# EAGLE design digitron clock (EAGLE 6.4)

## Sheet 1 of 2: nixies
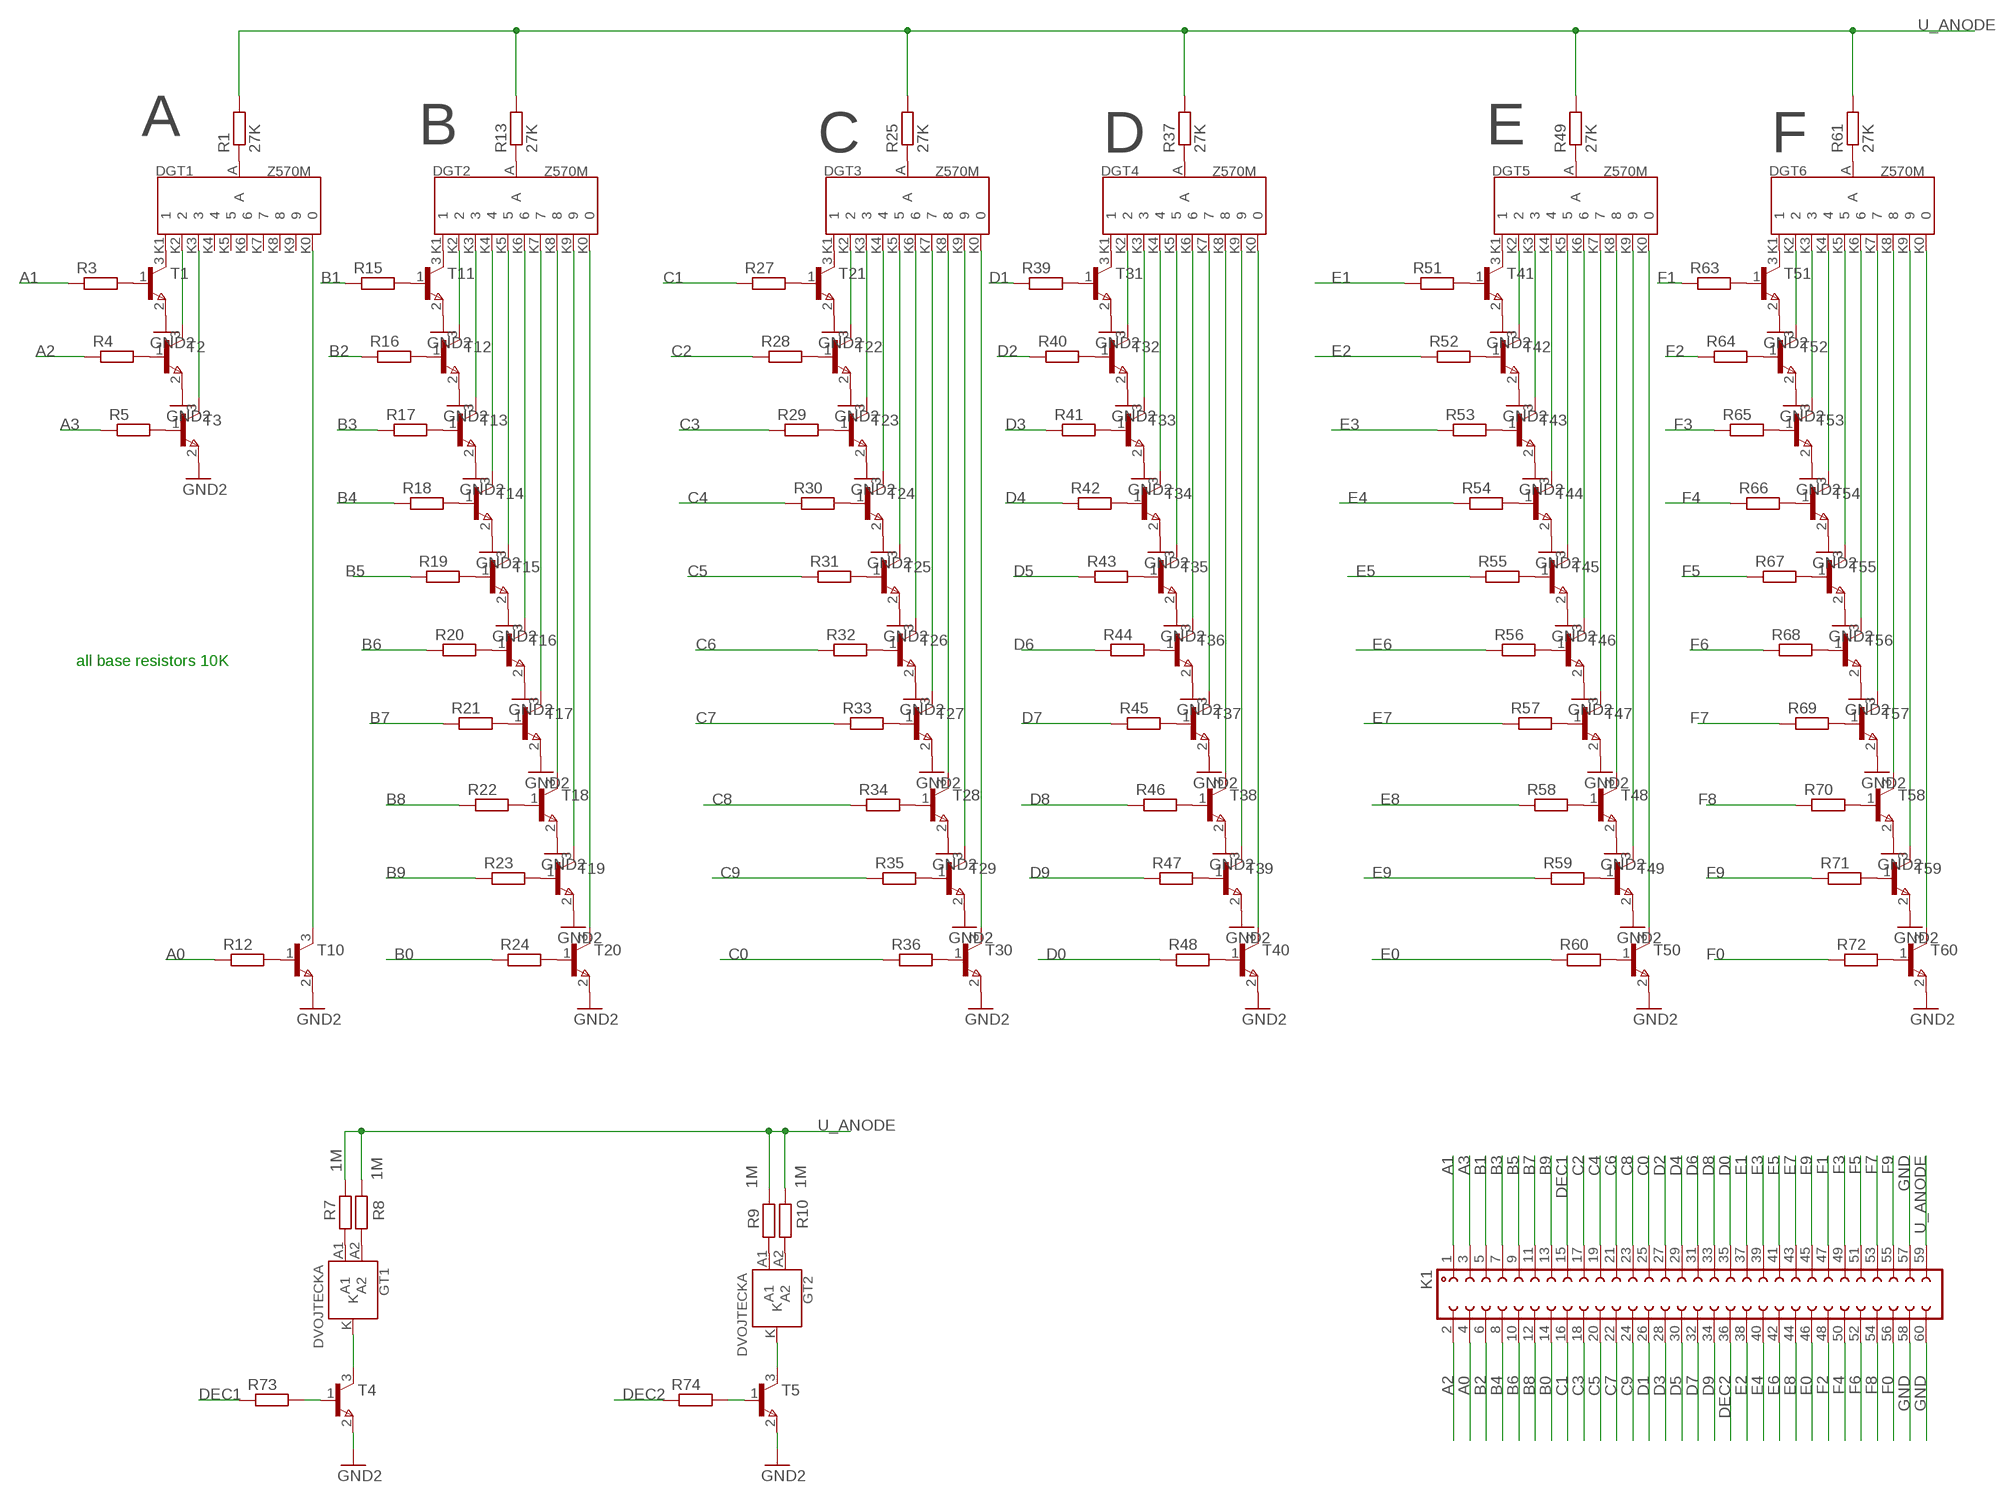
[diagram p0: schematic, sheet 1]

### Parts
DGT1  Z570M  [Z570M]
DGT2  Z570M  [Z570M]
DGT3  Z570M  [Z570M]
DGT4  Z570M  [Z570M]
DGT5  Z570M  [Z570M]
DGT6  Z570M  [Z570M]
GT1  DVOJTECKA  [DVOJTECKA]
GT2  DVOJTECKA  [DVOJTECKA]
K1  K_60PIN_F  [FE30-2]
R1  27K  R_SMD1206  [1206]
R3  R_SMD0603  [0603]
R4  R_SMD0603  [0603]
R5  R_SMD0603  [0603]
R7  1M  R_SMD1206  [1206]
R8  1M  R_SMD1206  [1206]
R9  1M  R_SMD1206  [1206]
R10  1M  R_SMD1206  [1206]
R12  R_SMD0603  [0603]
R13  27K  R_SMD1206  [1206]
R15  R_SMD0603  [0603]
R16  R_SMD0603  [0603]
R17  R_SMD0603  [0603]
R18  R_SMD0603  [0603]
R19  R_SMD0603  [0603]
R20  R_SMD0603  [0603]
R21  R_SMD0603  [0603]
R22  R_SMD0603  [0603]
R23  R_SMD0603  [0603]
R24  R_SMD0603  [0603]
R25  27K  R_SMD1206  [1206]
R27  R_SMD0603  [0603]
R28  R_SMD0603  [0603]
R29  R_SMD0603  [0603]
R30  R_SMD0603  [0603]
R31  R_SMD0603  [0603]
R32  R_SMD0603  [0603]
R33  R_SMD0603  [0603]
R34  R_SMD0603  [0603]
R35  R_SMD0603  [0603]
R36  R_SMD0603  [0603]
R37  27K  R_SMD1206  [1206]
R39  R_SMD0603  [0603]
R40  R_SMD0603  [0603]
R41  R_SMD0603  [0603]
R42  R_SMD0603  [0603]
R43  R_SMD0603  [0603]
R44  R_SMD0603  [0603]
R45  R_SMD0603  [0603]
R46  R_SMD0603  [0603]
R47  R_SMD0603  [0603]
R48  R_SMD0603  [0603]
R49  27K  R_SMD1206  [1206]
R51  R_SMD0603  [0603]
R52  R_SMD0603  [0603]
R53  R_SMD0603  [0603]
R54  R_SMD0603  [0603]
R55  R_SMD0603  [0603]
R56  R_SMD0603  [0603]
R57  R_SMD0603  [0603]
R58  R_SMD0603  [0603]
R59  R_SMD0603  [0603]
R60  R_SMD0603  [0603]
R61  27K  R_SMD1206  [1206]
R63  R_SMD0603  [0603]
R64  R_SMD0603  [0603]
R65  R_SMD0603  [0603]
R66  R_SMD0603  [0603]
R67  R_SMD0603  [0603]
R68  R_SMD0603  [0603]
R69  R_SMD0603  [0603]
R70  R_SMD0603  [0603]
R71  R_SMD0603  [0603]
R72  R_SMD0603  [0603]
R73  R_SMD0603  [0603]
R74  R_SMD0603  [0603]
T1  BC848B  [SOT-23]
T2  BC848B  [SOT-23]
T3  BC848B  [SOT-23]
T4  BC848B  [SOT-23]
T5  BC848B  [SOT-23]
T10  BC848B  [SOT-23]
T11  BC848B  [SOT-23]
T12  BC848B  [SOT-23]
T13  BC848B  [SOT-23]
T14  BC848B  [SOT-23]
T15  BC848B  [SOT-23]
T16  BC848B  [SOT-23]
T17  BC848B  [SOT-23]
T18  BC848B  [SOT-23]
T19  BC848B  [SOT-23]
T20  BC848B  [SOT-23]
T21  BC848B  [SOT-23]
T22  BC848B  [SOT-23]
T23  BC848B  [SOT-23]
T24  BC848B  [SOT-23]
T25  BC848B  [SOT-23]
T26  BC848B  [SOT-23]
T27  BC848B  [SOT-23]
T28  BC848B  [SOT-23]
T29  BC848B  [SOT-23]
T30  BC848B  [SOT-23]
T31  BC848B  [SOT-23]
T32  BC848B  [SOT-23]
T33  BC848B  [SOT-23]
T34  BC848B  [SOT-23]
T35  BC848B  [SOT-23]
T36  BC848B  [SOT-23]
T37  BC848B  [SOT-23]
T38  BC848B  [SOT-23]
T39  BC848B  [SOT-23]
T40  BC848B  [SOT-23]
T41  BC848B  [SOT-23]
T42  BC848B  [SOT-23]
T43  BC848B  [SOT-23]
T44  BC848B  [SOT-23]
T45  BC848B  [SOT-23]
T46  BC848B  [SOT-23]
T47  BC848B  [SOT-23]
T48  BC848B  [SOT-23]
T49  BC848B  [SOT-23]
T50  BC848B  [SOT-23]
T51  BC848B  [SOT-23]
T52  BC848B  [SOT-23]
T53  BC848B  [SOT-23]
T54  BC848B  [SOT-23]
T55  BC848B  [SOT-23]
T56  BC848B  [SOT-23]
T57  BC848B  [SOT-23]
T58  BC848B  [SOT-23]
T59  BC848B  [SOT-23]
T60  BC848B  [SOT-23]

### Nets
A0: K1.4 R12.1
A1: K1.1 R3.1
A2: K1.2 R4.1
A3: K1.3 R5.1
B0: K1.14 R24.1
B1: K1.5 R15.1
B2: K1.6 R16.1
B3: K1.7 R17.1
B4: K1.8 R18.1
B5: K1.9 R19.1
B6: K1.10 R20.1
B7: K1.11 R21.1
B8: K1.12 R22.1
B9: K1.13 R23.1
C0: K1.25 R36.1
C1: K1.16 R27.1
C2: K1.17 R28.1
C3: K1.18 R29.1
C4: K1.19 R30.1
C5: K1.20 R31.1
C6: K1.21 R32.1
C7: K1.22 R33.1
C8: K1.23 R34.1
C9: K1.24 R35.1
D0: K1.35 R48.1
D1: K1.26 R39.1
D2: K1.27 R40.1
D3: K1.28 R41.1
D4: K1.29 R42.1
D5: K1.30 R43.1
D6: K1.31 R44.1
D7: K1.32 R45.1
D8: K1.33 R46.1
D9: K1.34 R47.1
DEC1: K1.15 R73.1
DEC2: K1.36 R74.1
E0: K1.46 R60.1
E1: K1.37 R51.1
E2: K1.38 R52.1
E3: K1.39 R53.1
E4: K1.40 R54.1
E5: K1.41 R55.1
E6: K1.42 R56.1
E7: K1.43 R57.1
E8: K1.44 R58.1
E9: K1.45 R59.1
F0: K1.56 R72.1
F1: K1.47 R63.1
F2: K1.48 R64.1
F3: K1.49 R65.1
F4: K1.50 R66.1
F5: K1.51 R67.1
F6: K1.52 R68.1
F7: K1.53 R69.1
F8: K1.54 R70.1
F9: K1.55 R71.1
GND: K1.57 K1.58 K1.60 T1.2(E) T2.2(E) T3.2(E) T4.2(E) T5.2(E) T10.2(E) T11.2(E) T12.2(E) T13.2(E) T14.2(E) T15.2(E) T16.2(E) T17.2(E) T18.2(E) T19.2(E) T20.2(E) T21.2(E) T22.2(E) T23.2(E) T24.2(E) T25.2(E) T26.2(E) T27.2(E) T28.2(E) T29.2(E) T30.2(E) T31.2(E) T32.2(E) T33.2(E) T34.2(E) T35.2(E) T36.2(E) T37.2(E) T38.2(E) T39.2(E) T40.2(E) T41.2(E) T42.2(E) T43.2(E) T44.2(E) T45.2(E) T46.2(E) T47.2(E) T48.2(E) T49.2(E) T50.2(E) T51.2(E) T52.2(E) T53.2(E) T54.2(E) T55.2(E) T56.2(E) T57.2(E) T58.2(E) T59.2(E) T60.2(E) ; supply symbol labelled GND2
N$1: DGT1.K1 T1.3(C)
N$2: DGT1.K2 T2.3(C)
N$3: DGT1.K3 T3.3(C)
N$4: GT1.A1 R7.1
N$5: GT1.A2 R8.1
N$6: GT2.A1 R9.1
N$7: GT1.K T4.3(C)
N$8: GT2.K T5.3(C)
N$9: R74.2 T5.1(B)
N$10: DGT1.K0 T10.3(C)
N$11: GT2.A2 R10.1
N$12: DGT1.A R1.1
N$13: R3.2 T1.1(B)
N$14: R4.2 T2.1(B)
N$15: R5.2 T3.1(B)
N$16: R73.2 T4.1(B)
N$22: R12.2 T10.1(B)
N$23: DGT2.K1 T11.3(C)
N$24: DGT2.K2 T12.3(C)
N$25: DGT2.K3 T13.3(C)
N$26: DGT2.K4 T14.3(C)
N$27: DGT2.K5 T15.3(C)
N$28: DGT2.K6 T16.3(C)
N$29: DGT2.K7 T17.3(C)
N$30: DGT2.K8 T18.3(C)
N$31: DGT2.K9 T19.3(C)
N$32: DGT2.K0 T20.3(C)
N$34: DGT2.A R13.1
N$35: R15.2 T11.1(B)
N$36: R16.2 T12.1(B)
N$37: R17.2 T13.1(B)
N$38: R18.2 T14.1(B)
N$39: R19.2 T15.1(B)
N$40: R20.2 T16.1(B)
N$41: R21.2 T17.1(B)
N$42: R22.2 T18.1(B)
N$43: R23.2 T19.1(B)
N$44: R24.2 T20.1(B)
N$45: DGT3.K1 T21.3(C)
N$46: DGT3.K2 T22.3(C)
N$47: DGT3.K3 T23.3(C)
N$48: DGT3.K4 T24.3(C)
N$49: DGT3.K5 T25.3(C)
N$50: DGT3.K6 T26.3(C)
N$51: DGT3.K7 T27.3(C)
N$52: DGT3.K8 T28.3(C)
N$53: DGT3.K9 T29.3(C)
N$54: DGT3.K0 T30.3(C)
N$56: DGT3.A R25.1
N$57: R27.2 T21.1(B)
N$58: R28.2 T22.1(B)
N$59: R29.2 T23.1(B)
N$60: R30.2 T24.1(B)
N$61: R31.2 T25.1(B)
N$62: R32.2 T26.1(B)
N$63: R33.2 T27.1(B)
N$64: R34.2 T28.1(B)
N$65: R35.2 T29.1(B)
N$66: R36.2 T30.1(B)
N$67: DGT4.K1 T31.3(C)
N$68: DGT4.K2 T32.3(C)
N$69: DGT4.K3 T33.3(C)
N$70: DGT4.K4 T34.3(C)
N$71: DGT4.K5 T35.3(C)
N$72: DGT4.K6 T36.3(C)
N$73: DGT4.K7 T37.3(C)
N$74: DGT4.K8 T38.3(C)
N$75: DGT4.K9 T39.3(C)
N$76: DGT4.K0 T40.3(C)
N$78: DGT4.A R37.1
N$79: R39.2 T31.1(B)
N$80: R40.2 T32.1(B)
N$81: R41.2 T33.1(B)
N$82: R42.2 T34.1(B)
N$83: R43.2 T35.1(B)
N$84: R44.2 T36.1(B)
N$85: R45.2 T37.1(B)
N$86: R46.2 T38.1(B)
N$87: R47.2 T39.1(B)
N$88: R48.2 T40.1(B)
N$89: DGT5.K1 T41.3(C)
N$90: DGT5.K2 T42.3(C)
N$91: DGT5.K3 T43.3(C)
N$92: DGT5.K4 T44.3(C)
N$93: DGT5.K5 T45.3(C)
N$94: DGT5.K6 T46.3(C)
N$95: DGT5.K7 T47.3(C)
N$96: DGT5.K8 T48.3(C)
N$97: DGT5.K9 T49.3(C)
N$98: DGT5.K0 T50.3(C)
N$100: DGT5.A R49.1
N$101: R51.2 T41.1(B)
N$102: R52.2 T42.1(B)
N$103: R53.2 T43.1(B)
N$104: R54.2 T44.1(B)
N$105: R55.2 T45.1(B)
N$106: R56.2 T46.1(B)
N$107: R57.2 T47.1(B)
N$108: R58.2 T48.1(B)
N$109: R59.2 T49.1(B)
N$110: R60.2 T50.1(B)
N$111: DGT6.K1 T51.3(C)
N$112: DGT6.K2 T52.3(C)
N$113: DGT6.K3 T53.3(C)
N$114: DGT6.K4 T54.3(C)
N$115: DGT6.K5 T55.3(C)
N$116: DGT6.K6 T56.3(C)
N$117: DGT6.K7 T57.3(C)
N$118: DGT6.K8 T58.3(C)
N$119: DGT6.K9 T59.3(C)
N$120: DGT6.K0 T60.3(C)
N$122: DGT6.A R61.1
N$123: R63.2 T51.1(B)
N$124: R64.2 T52.1(B)
N$125: R65.2 T53.1(B)
N$126: R66.2 T54.1(B)
N$127: R67.2 T55.1(B)
N$128: R68.2 T56.1(B)
N$129: R69.2 T57.1(B)
N$130: R70.2 T58.1(B)
N$131: R71.2 T59.1(B)
N$132: R72.2 T60.1(B)
U_ANODE: K1.59 R1.2 R7.2 R8.2 R9.2 R10.2 R13.2 R25.2 R37.2 R49.2 R61.2
Unconnected: DGT1.K4 DGT1.K5 DGT1.K6 DGT1.K7 DGT1.K8 DGT1.K9

### Notes on the sheet
- A | B | C | D | E | F
- all base resistors 10K

## Sheet 2 of 2: control
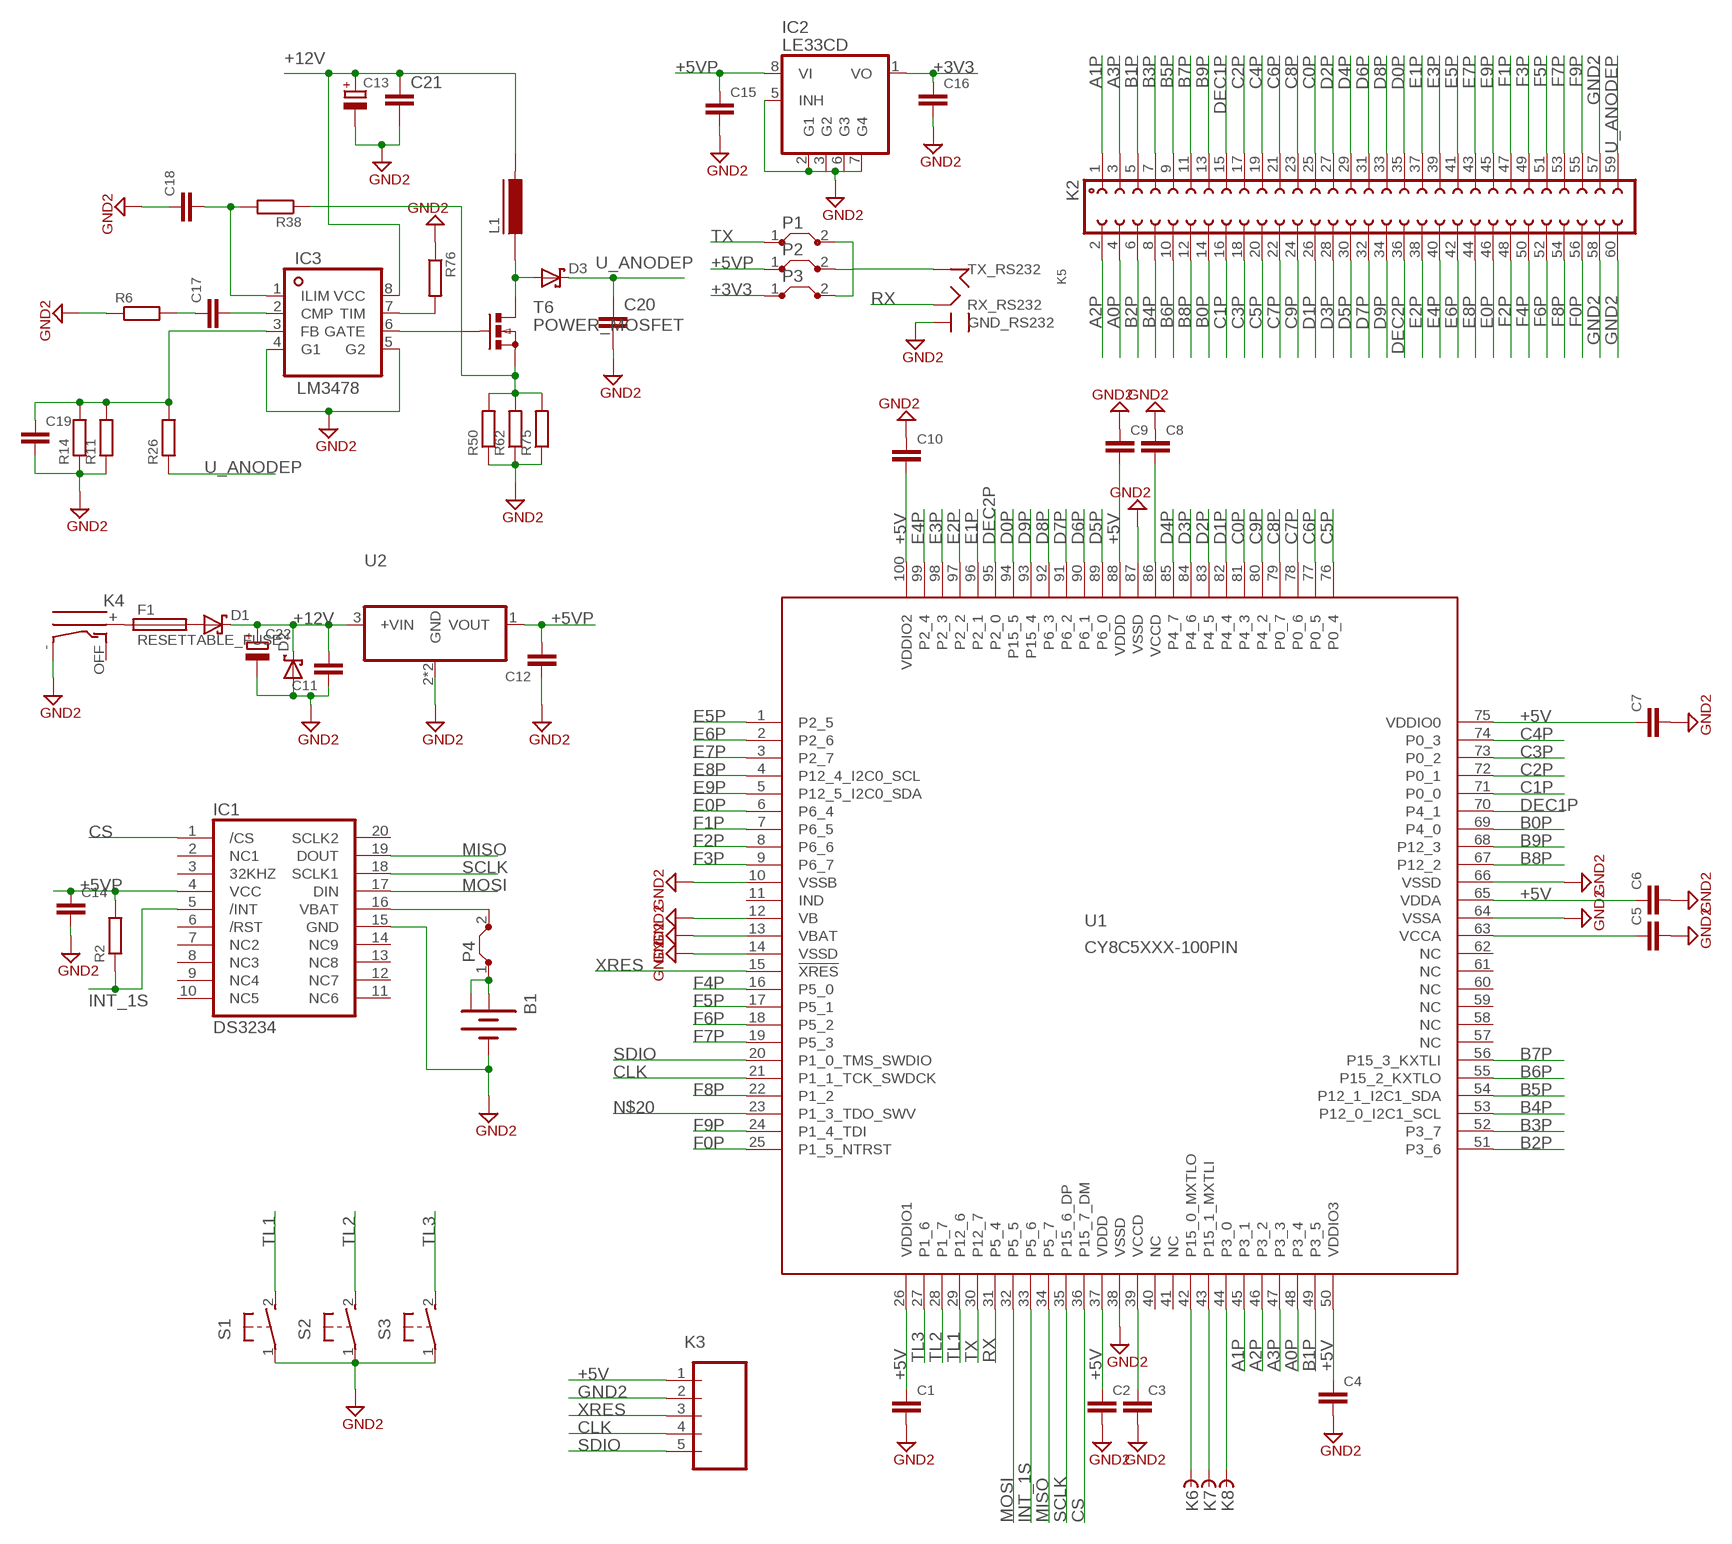
[diagram p1: schematic, sheet 2]

### Parts
B1  BATERIE3VX  [CR2430X]
C1  C_SMD0603  [0603]
C2  C_SMD0603  [0603]
C3  C_SMD0603  [0603]
C4  C_SMD0603  [0603]
C5  C_SMD0603  [0603]
C6  C_SMD0603  [0603]
C7  C_SMD0603  [0603]
C8  C_SMD0603  [0603]
C9  C_SMD0603  [0603]
C10  C_SMD0603  [0603]
C11  C_SMD0603  [0603]
C12  C_SMD0603  [0603]
C13  C_TANTALC-D  [C-D]
C14  C_SMD0603  [0603]
C15  C_SMD0603  [0603]
C16  C_SMD0603  [0603]
C17  C_SMD0603  [0603]
C18  C_SMD0603  [0603]
C19  C_SMD0603  [0603]
C20  C_SMD2220  [2220]
C21  C_SMD0603  [0603]
C22  C_TANTALC-D  [C-D]
D1  10BQ040  [D-SMB]
D2  10BQ040  [D-SMB]
D3  10BQ040  [D-SMB]
F1  RESETTABLE_FUSE  [SMD1812]
IC1  DS3234  [SO20L]
IC2  LE33CD  [SO8]
IC3  LM3478  [SO8]
K2  K_60PIN_F  [FE30-2]
K3  MA5-1  [MA5-1]
K4  DC_CONNECTOR_RAPC712  [DC_CONECTOR_RAPC712]
K5  JACK  [JACK]
K6  FUTURE_PAD  [FUTURE_PAD]
K7  FUTURE_PAD  [FUTURE_PAD]
K8  FUTURE_PAD  [FUTURE_PAD]
L1  DR127  [DR127]
P1  K_SMD_PROPOJKA  [JUMP-2]
P2  K_SMD_PROPOJKA  [JUMP-2]
P3  K_SMD_PROPOJKA  [JUMP-2]
P4  K_SMD_PROPOJKA  [JUMP-2]
R2  R_SMD0603  [0603]
R6  R_SMD0603  [0603]
R11  R_SMD0603  [0603]
R14  R_SMD0603  [0603]
R26  R_SMD0603  [0603]
R38  R_SMD0603  [0603]
R50  R_SMD0805  [0805]
R62  R_SMD0805  [0805]
R75  R_SMD0805  [0805]
R76  R_SMD0603  [0603]
S1  31-XX  [B3F-31XX]
S2  31-XX  [B3F-31XX]
S3  31-XX  [B3F-31XX]
T6  POWER_MOSFET  [TO252]
U1  CY8C5XXX-100PIN  [TQFP-14X14-100]
U2  78XXSOT89  [SOT89]

### Nets
+3V3: C16.1 IC2.1(VO) P3.1
+5V: C1.1 C2.1 C4.1 C6.1 C7.1 C9.2 C10.2 K3.1 U1.26(VDDIO1) U1.37(VDDD) U1.50(VDDIO3) U1.65(VDDA) U1.75(VDDIO0) U1.88(VDDD) U1.100(VDDIO2)
+5VP: C12.2 C14.1 C15.1 IC1.4(VCC) IC2.8(VI) P2.1 R2.2 U2.1(VOUT)
+12V: C11.2 C13.+ C21.1 C22.+ D1.K D2.K IC3.8(VCC) L1.P$2 U2.3(+VIN)
A0P: K2.4 U1.48(P3_4)
A1P: K2.1 U1.45(P3_1)
A2P: K2.2 U1.46(P3_2)
A3P: K2.3 U1.47(P3_3)
B0P: K2.14 U1.69(P4_0)
B1P: K2.5 U1.49(P3_5)
B2P: K2.6 U1.51(P3_6)
B3P: K2.7 U1.52(P3_7)
B4P: K2.8 U1.53(P12_0_I2C1_SCL)
B5P: K2.9 U1.54(P12_1_I2C1_SDA)
B6P: K2.10 U1.55(P15_2_KXTLO)
B7P: K2.11 U1.56(P15_3_KXTLI)
B8P: K2.12 U1.67(P12_2)
B9P: K2.13 U1.68(P12_3)
C0P: K2.25 U1.81(P4_3)
C1P: K2.16 U1.71(P0_0)
C2P: K2.17 U1.72(P0_1)
C3P: K2.18 U1.73(P0_2)
C4P: K2.19 U1.74(P0_3)
C5P: K2.20 U1.76(P0_4)
C6P: K2.21 U1.77(P0_5)
C7P: K2.22 U1.78(P0_6)
C8P: K2.23 U1.79(P0_7)
C9P: K2.24 U1.80(P4_2)
CLK: K3.4 U1.21(P1_1_TCK_SWDCK)
CS: IC1.1(/CS) U1.36(P15_7_DM)
D0P: K2.35 U1.94(P15_5)
D1P: K2.26 U1.82(P4_4)
D2P: K2.27 U1.83(P4_5)
D3P: K2.28 U1.84(P4_6)
D4P: K2.29 U1.85(P4_7)
D5P: K2.30 U1.89(P6_0)
D6P: K2.31 U1.90(P6_1)
D7P: K2.32 U1.91(P6_2)
D8P: K2.33 U1.92(P6_3)
D9P: K2.34 U1.93(P15_4)
DEC1P: K2.15 U1.70(P4_1)
DEC2P: K2.36 U1.95(P2_0)
E0P: K2.46 U1.6(P6_4)
E1P: K2.37 U1.96(P2_1)
E2P: K2.38 U1.97(P2_2)
E3P: K2.39 U1.98(P2_3)
E4P: K2.40 U1.99(P2_4)
E5P: K2.41 U1.1(P2_5)
E6P: K2.42 U1.2(P2_6)
E7P: K2.43 U1.3(P2_7)
E8P: K2.44 U1.4(P12_4_I2C0_SCL)
E9P: K2.45 U1.5(P12_5_I2C0_SDA)
F0P: K2.56 U1.25(P1_5_NTRST)
F1P: K2.47 U1.7(P6_5)
F2P: K2.48 U1.8(P6_6)
F3P: K2.49 U1.9(P6_7)
F4P: K2.50 U1.16(P5_0)
F5P: K2.51 U1.17(P5_1)
F6P: K2.52 U1.18(P5_2)
F7P: K2.53 U1.19(P5_3)
F8P: K2.54 U1.22(P1_2)
F9P: K2.55 U1.24(P1_4_TDI)
GND2: B1.- C1.2 C2.2 C3.2 C4.2 C5.2 C6.2 C7.2 C8.1 C9.1 C10.1 C11.1 C12.1 C13.- C14.2 C15.2 C16.2 C18.1 C19.2 C20.2 C21.2 C22.- D2.A IC1.15(GND) IC2.2(G1) IC2.3(G2) IC2.5(INH) IC2.6(G3) IC2.7(G4) IC3.4(G1) IC3.5(G2) K2.57 K2.58 K2.60 K3.2 K4.- K5.GND_RS232 R6.1 R11.1 R14.1 R50.1 R62.1 R75.1 R76.1 S1.1(P) S2.1(P) S3.1(P) U1.10(VSSB) U1.12(VB) U1.13(VBAT) U1.14(VSSD) U1.38(VSSD) U1.64(VSSA) U1.66(VSSD) U1.87(VSSD) U2.2(GND) U2.4(GND)
INT_1S: IC1.5(/INT) R2.1 U1.33(P5_6)
MISO: IC1.19(DOUT) U1.34(P5_7)
MOSI: IC1.17(DIN) U1.32(P5_5)
N$17: F1.A K4.+
N$18: D1.A F1.K
N$19: C3.1 U1.39(VCCD)
N$20: U1.23(P1_3_TDO_SWV)
N$21: K5.TX_RS232 P1.2 P2.2 P3.2
N$33: C5.1 U1.63(VCCA)
N$55: K6.1(C) U1.42(P15_0_MXTLO)
N$77: C17.2 IC3.2(CMP)
N$99: C8.2 U1.86(VCCD)
N$121: C17.1 R6.2
N$133: B1.+ B1.+@1(+) P4.1
N$134: C19.1 IC3.3(FB) R11.2 R14.2 R26.2
N$135: K7.1(C) U1.43(P15_1_MXTLI)
N$136: IC3.6(GATE) T6.1(G)
N$137: R38.1 R50.2 R62.2 R75.2 T6.2(S)
N$138: K8.1(C) U1.44(P3_0)
N$139: C18.2 IC3.1(ILIM) R38.2
N$140: IC3.7(TIM) R76.2
N$141: D3.A L1.P$1 T6.3(D)
N$142: IC1.16(VBAT) P4.2
RX: K5.RX_RS232 U1.31(P5_4)
SCLK: IC1.18(SCLK1) U1.35(P15_6_DP)
SDIO: K3.5 U1.20(P1_0_TMS_SWDIO)
TL1: S1.2(S) U1.29(P12_6)
TL2: S2.2(S) U1.28(P1_7)
TL3: S3.2(S) U1.27(P1_6)
TX: P1.1 U1.30(P12_7)
U_ANODEP: C20.1 D3.K K2.59 R26.1
XRES: K3.3 U1.15(!XRES!)
Unconnected: IC1.2(NC1) IC1.3(32KHZ) IC1.6(/RST) IC1.7(NC2) IC1.8(NC3) IC1.9(NC4) IC1.10(NC5) IC1.11(NC6) IC1.12(NC7) IC1.13(NC8) IC1.14(NC9) IC1.20(SCLK2) K4.OFF U1.11(IND) U1.40(NC) U1.41(NC) U1.57(NC) U1.58(NC) U1.59(NC) U1.60(NC) U1.61(NC) U1.62(NC)

## Library data of the parts
B1 = ex_pocitac:BATERIE3VX
C1-C10 = digitron:C_SMD
C11 C12 = dms_mz:C_SMD
C13 C22 = ex_pocitac:C_TANTAL
C14-C19 = ex_pocitac:C_SMD
C20 C21 = Explonix_power:C_SMD
D1 D2 = dms_mz:10BQ040
D3 = ex_pocitac:10BQ040
DGT1-DGT6 = digitron:Z570M
F1 = dms_mz:RESETTABLE_FUSE
GT1 GT2 = digitron:DVOJTECKA
IC1 = ex_pocitac:DS3234
IC2 = ex_pocitac:LE33CD
IC3 = digitron:LM3478
K1 K2 = digitron:K_60PIN_F
K3 = psoc4qfn:MA5-1
K4 = mini_ex-120215:DC_CONNECTOR_RAPC712
K5 = mini_ex-120215:JACK
K6-K8 = ex_pocitac:FUTURE_PAD
L1 = ex_pocitac:DR127
P1-P4 = ex_pocitac:K_SMD_PROPOJKA
R1 R3-R5 R7-R10 R12 R13 R15-R25 R27-R37 R39-R49 R51-R61 R63-R74 = digitron:R_SMD
R2 R6 R11 R14 R26 R38 R50 R62 R75 R76 = ex_pocitac:R_SMD
S1-S3 = switch-omron:31-XX: OMRON SWITCH; MPN: B3F-3100; OC_FARNELL: 959704; OC_NEWARK: 36M3582
T1-T5 T10-T60 = digitron:BC848B
T6 = digitron:POWER_MOSFET
U1 = procesory:CY8C5XXX-100PIN: Cypress PSoC® 5 - Programmable System on Chip, ARM Cortex-M3 Based Source Data: http://www.cypress.com/?mpn=CY8C5588AXI-060 LBR Source: http://www.westmarkelectronics.com Thomas W. Moxon Director of Engineering www.westmarkelectronics.com; MPN: CY8C5588AXI-060
U2 = dms_mz:78XX

## Board
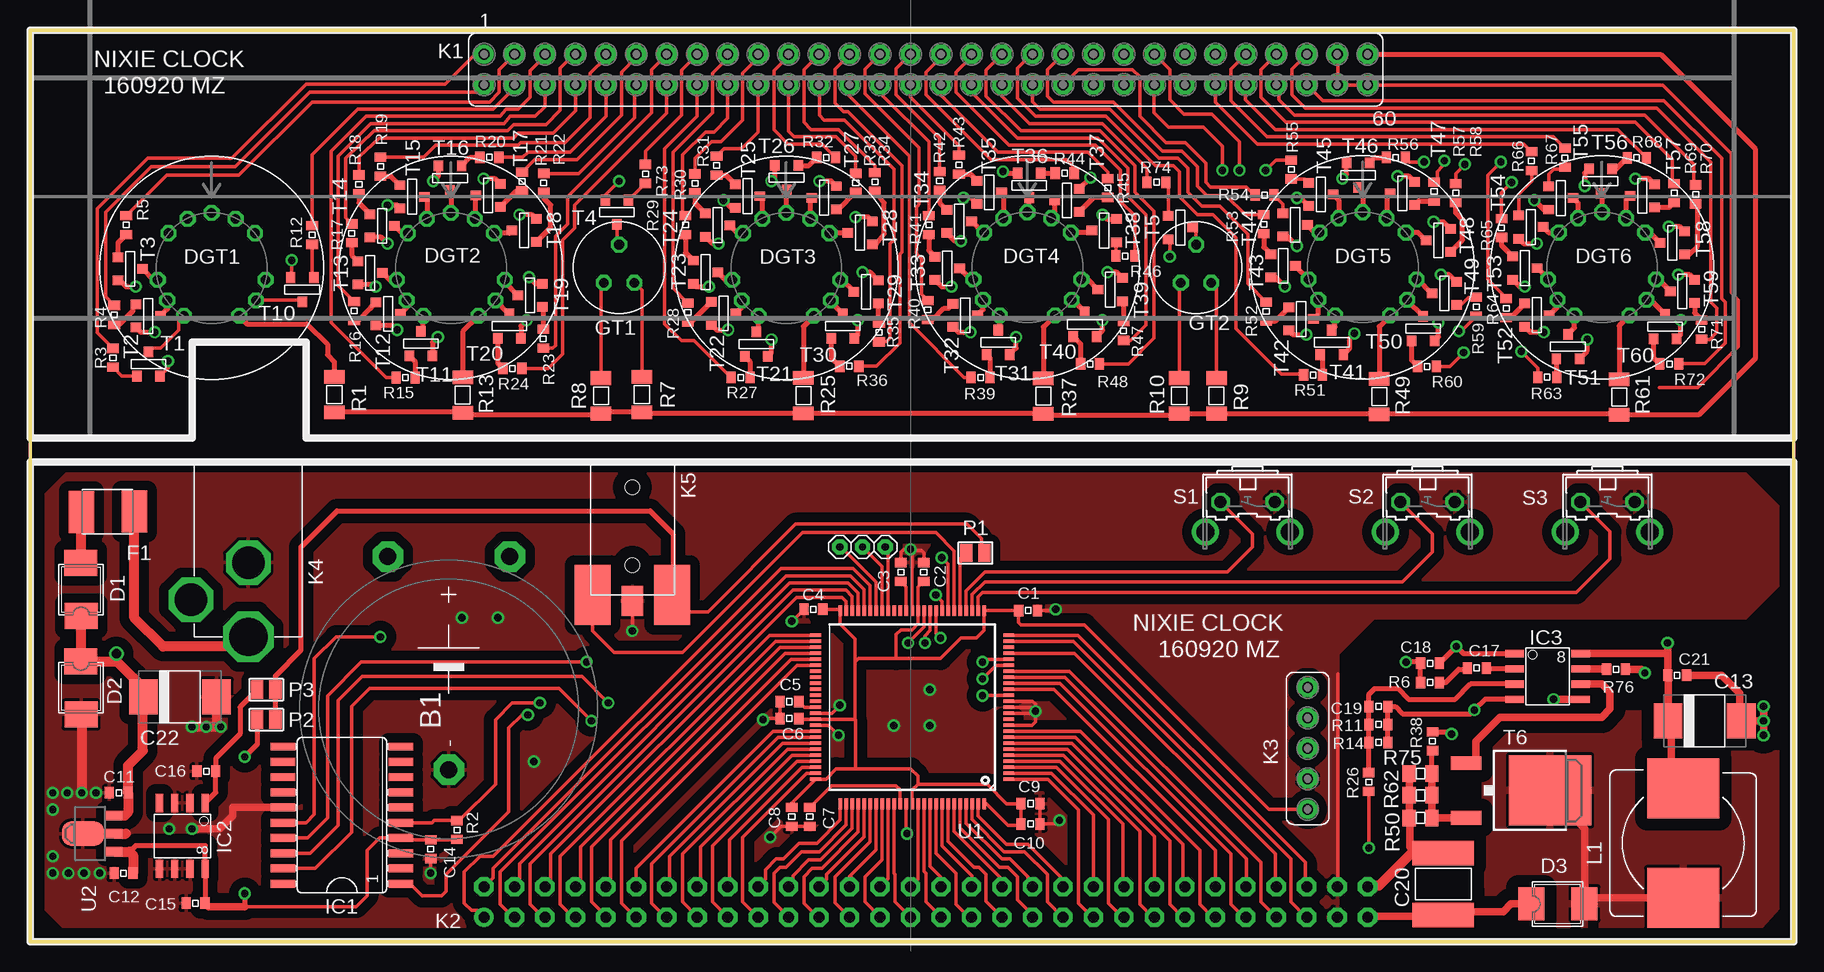
[diagram p2: board, top side]
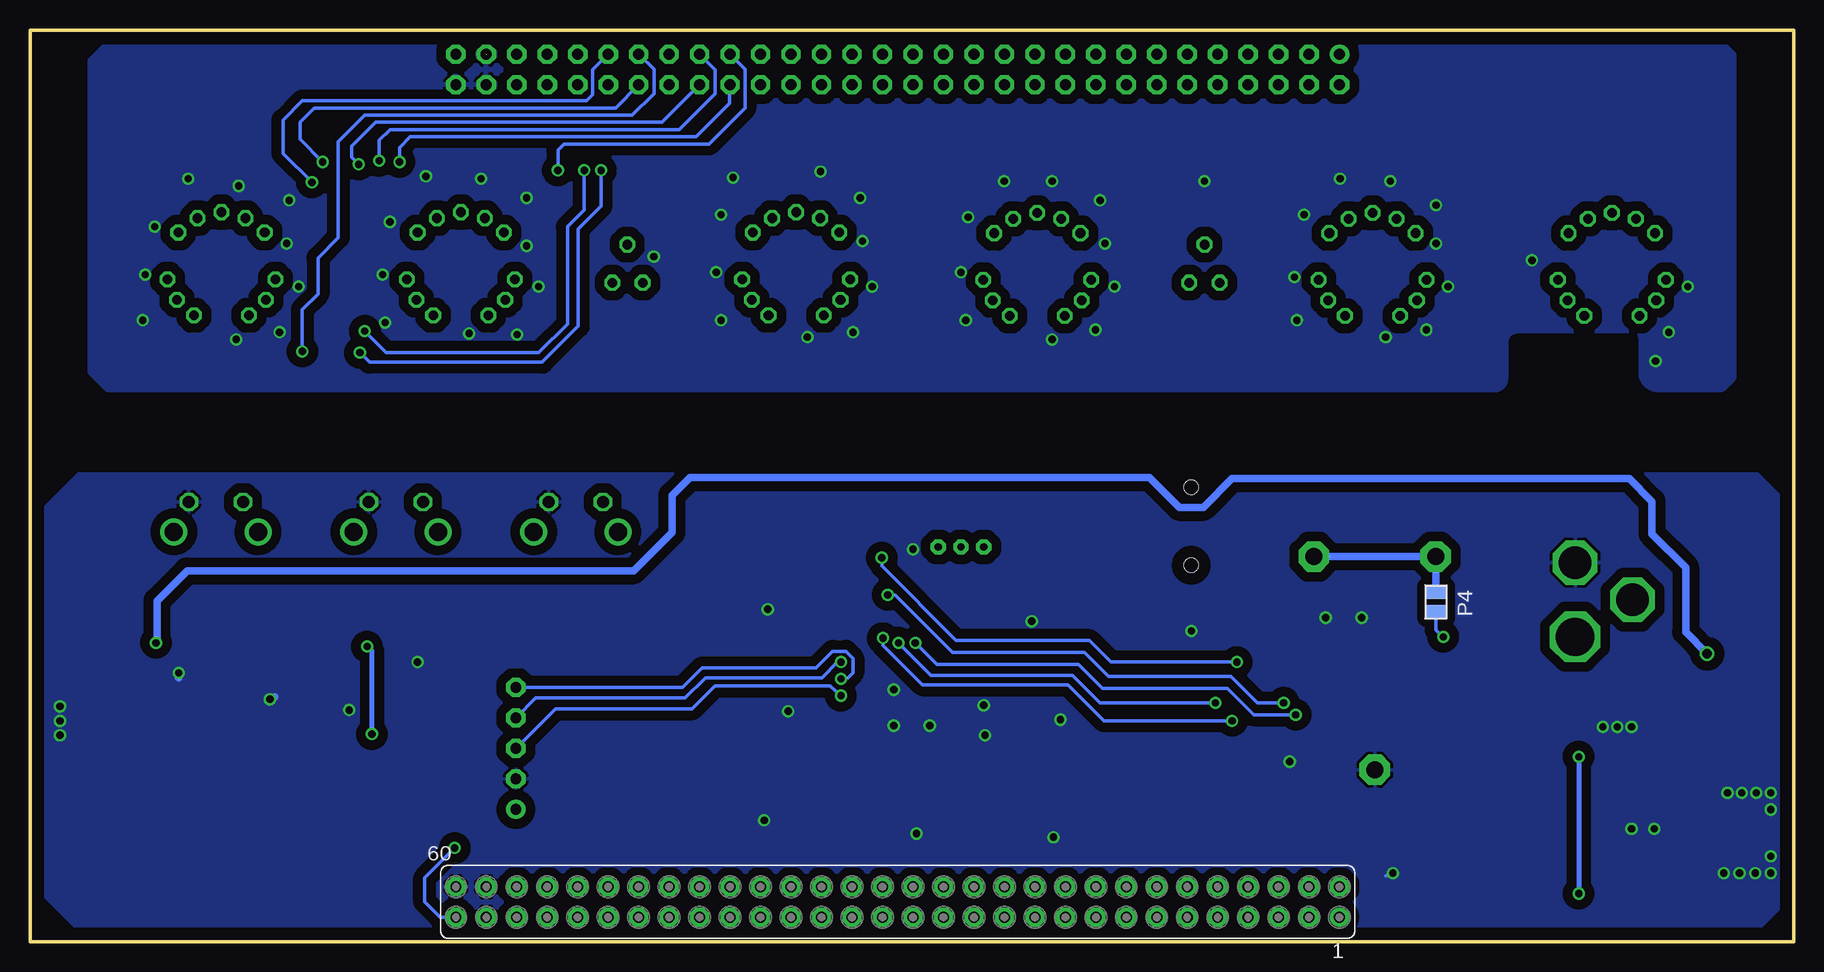
[diagram p3: board, bottom side, seen from below]

Size 147 x 76 mm. Coordinates in mm from the lower left corner, seen from the top.
Outline: 0,0 147,0 147,76 0,76 0,0
Copper layers (1*16): Top 0.035mm / dielectric 1.5mm / Bottom 0.035mm
Design rules "default *": minimum track width 10mil, minimum drill 20mil, track to track 6mil, track to pad 6mil, pad to pad 6mil, via to via 6mil, smd to smd 6mil, copper to edge 40mil, drill to drill 8mil, minimum pad ring 10mil, minimum via ring 8mil, stop-mask expansion 4mil, vias tented up to drill 24mil, thermal gap 10mil

### Footprints (pad centres in the part's own frame; a part is rotated, then mirrored left to right if it is on the bottom)
CR2430X = drill 1.422 pad 2.54 octagon: + 12.7,-5.08; +@1 12.7,5.08; - -5.08,0
0603 = smd 0.762 x 0.965: 1 -0.787,0; 2 0.787,0
C-D = smd 2.388 x 2.896: + -3.048,0; - 3.048,0
2220 = smd 2.032 x 5.105: 1 -2.591,0; 2 2.591,0
D-SMB = smd 2.159 x 2.743: A 2.267,0.057; K -2.153,0.032
Z570M = drill 0.8 octagon: A 2.3,-4; K0 3.7,-2.7; K1 -2.3,-4; K2 -3.7,-2.7; K3 -4.5,-1; K4 -3.6,2.9; K5 -2,4.1; K6 0,4.6; K7 2,4.1; K8 3.6,2.9; K9 4.5,-1
SMD1812 = smd 2.159 x 3.5: A 2.108,0.057; K -2.311,0.032
DVOJTECKA = drill 0.8 octagon: A1 -1.27,1.27; A2 1.27,1.27; K 0,-1.905
SO20L = smd 0.66 x 2.032: 1 -5.08,-4.902; 2 -3.81,-4.902; 3 -2.54,-4.902; 4 -1.27,-4.902; 5 0,-4.902; 6 1.27,-4.902; 7 2.54,-4.902; 8 3.81,-4.902; 9 5.08,-4.902; 10 6.35,-4.902; 11 6.35,4.902; 12 5.08,4.902; 13 3.81,4.902; 14 2.54,4.902; 15 1.27,4.902; 16 0,4.902; 17 -1.27,4.902; 18 -2.54,4.902; 19 -3.81,4.902; 20 -5.08,4.902
SO8 = smd 0.61 x 1.524: 1 -1.905,-2.743; 2 -0.635,-2.743; 3 0.635,-2.743; 4 1.905,-2.743; 5 1.905,2.743; 6 0.635,2.743; 7 -0.635,2.743; 8 -1.905,2.743
FE30-2 = drill 0.914 pad 1.6: 1 -35.56,1.27 | drill 0.914 pad 1.6 octagon: 2 -35.56,-1.27; 3 -33.02,1.27; 4 -33.02,-1.27; 5 -30.48,1.27; 6 -30.48,-1.27; 7 -27.94,1.27; 8 -27.94,-1.27; 9 -25.4,1.27; 10 -25.4,-1.27; 11 -22.86,1.27; 12 -22.86,-1.27; 13 -20.32,1.27; 14 -20.32,-1.27; 15 -17.78,1.27; 16 -17.78,-1.27; 17 -15.24,1.27; 18 -15.24,-1.27; 19 -12.7,1.27; 20 -12.7,-1.27; 21 -10.16,1.27; 22 -10.16,-1.27; 23 -7.62,1.27; 24 -7.62,-1.27; 25 -5.08,1.27; 26 -5.08,-1.27; 27 -2.54,1.27; 28 -2.54,-1.27; 29 0,1.27; 30 0,-1.27; 31 2.54,1.27; 32 2.54,-1.27; 33 5.08,1.27; 34 5.08,-1.27; 35 7.62,1.27; 36 7.62,-1.27; 37 10.16,1.27; 38 10.16,-1.27; 39 12.7,1.27; 40 12.7,-1.27; 41 15.24,1.27; 42 15.24,-1.27; 43 17.78,1.27; 44 17.78,-1.27; 45 20.32,1.27; 46 20.32,-1.27; 47 22.86,1.27; 48 22.86,-1.27; 49 25.4,1.27; 50 25.4,-1.27; 51 27.94,1.27; 52 27.94,-1.27; 53 30.48,1.27; 54 30.48,-1.27; 55 33.02,1.27; 56 33.02,-1.27; 57 35.56,1.27; 58 35.56,-1.27; 59 38.1,1.27; 60 38.1,-1.27
MA5-1 = drill 0.914 pad 1.6: 1 5.08,0 | drill 0.914 pad 1.6 octagon: 2 2.54,0; 3 0,0; 4 -2.54,0; 5 -5.08,0
DC_CONECTOR_RAPC712 = drill 3.2 octagon: + 0,0 | drill 2.7 octagon: - 0,-6.2; OFF 4.8,-3.1
JACK = smd 1.8 x 2.5: GND_RS232 -0.013,3.016 | smd 3 x 5: RX_RS232 3.287,2.516; TX_RS232 -3.313,2.516 | hole 1.2: -0.013,-6.484; -0.013,0.016
FUTURE_PAD = drill 0.6 pad 1.27 octagon: 1 0,0
DR127 = smd 5 x 6: P$1 -4.572,0; P$2 4.572,0
JUMP-2 = smd 1.016 x 1.524: 1 -0.762,0; 2 0.762,0
1206 = smd 1.143 x 1.702: 1 -1.473,0; 2 1.473,0
0805 = smd 1.092 x 1.397: 1 -0.94,0; 2 0.94,0
B3F-31XX = drill 1.016 octagon: 1 -2.261,-1.245; 2 2.261,-1.245 | drill 1.499 pad 2.159: 3 -3.505,1.245; 4 3.505,1.245
SOT-23 = smd 0.787 x 0.889: 1 0.991,1.016; 2 -0.94,1.016; 3 0.025,-1.016
TO252 = smd 1.143 x 2.54: 1 -2.28,-4.482; 2 2.28,-4.482 | smd 5.842 x 6.858: 3 0,2.5
TQFP-14X14-100 = smd 0.9 x 0.3: 1 -8.05,6; 2 -8.05,5.5; 3 -8.05,5; 4 -8.05,4.5; 5 -8.05,4; 6 -8.05,3.5; 7 -8.05,3; 8 -8.05,2.5; 9 -8.05,2; 10 -8.05,1.5; 11 -8.05,1; 12 -8.05,0.5; 13 -8.05,0; 14 -8.05,-0.5; 15 -8.05,-1; 16 -8.05,-1.5; 17 -8.05,-2; 18 -8.05,-2.5; 19 -8.05,-3; 20 -8.05,-3.5; 21 -8.05,-4; 22 -8.05,-4.5; 23 -8.05,-5; 24 -8.05,-5.5; 25 -8.05,-6; 51 8.05,-6; 52 8.05,-5.5; 53 8.05,-5; 54 8.05,-4.5; 55 8.05,-4; 56 8.05,-3.5; 57 8.05,-3; 58 8.05,-2.5; 59 8.05,-2; 60 8.05,-1.5; 61 8.05,-1; 62 8.05,-0.5; 63 8.05,0; 64 8.05,0.5; 65 8.05,1; 66 8.05,1.5; 67 8.05,2; 68 8.05,2.5; 69 8.05,3; 70 8.05,3.5; 71 8.05,4; 72 8.05,4.5; 73 8.05,5; 74 8.05,5.5; 75 8.05,6 | smd 0.3 x 0.9: 26 -6,-8.05; 27 -5.5,-8.05; 28 -5,-8.05; 29 -4.5,-8.05; 30 -4,-8.05; 31 -3.5,-8.05; 32 -3,-8.05; 33 -2.5,-8.05; 34 -2,-8.05; 35 -1.5,-8.05; 36 -1,-8.05; 37 -0.5,-8.05; 38 0,-8.05; 39 0.5,-8.05; 40 1,-8.05; 41 1.5,-8.05; 42 2,-8.05; 43 2.5,-8.05; 44 3,-8.05; 45 3.5,-8.05; 46 4,-8.05; 47 4.5,-8.05; 48 5,-8.05; 49 5.5,-8.05; 50 6,-8.05; 76 6,8.05; 77 5.5,8.05; 78 5,8.05; 79 4.5,8.05; 80 4,8.05; 81 3.5,8.05; 82 3,8.05; 83 2.5,8.05; 84 2,8.05; 85 1.5,8.05; 86 1,8.05; 87 0.5,8.05; 88 0,8.05; 89 -0.5,8.05; 90 -1,8.05; 91 -1.5,8.05; 92 -2,8.05; 93 -2.5,8.05; 94 -3,8.05; 95 -3.5,8.05; 96 -4,8.05; 97 -4.5,8.05; 98 -5,8.05; 99 -5.5,8.05; 100 -6,8.05
SOT89 = smd 0.762 x 1.397: 1 -1.5,-2; 2 0,-2 | smd 0.8 x 1.4: 3 1.5,-2 | smd 2 x 3.5: 4 0,0.6

### Placement (x,y rotation side)
B1  34.9,19.4 90 top
C1  83.2,27.6 0 top
C2  74.5,30.8 90 top
C3  72.6,30.8 90 top
C4  65.3,27.7 180 top
C5  63.3,20 180 top
C6  63.3,18.6 180 top
C7  63.5,10.4 270 top
C8  65,10.4 90 top
C9  83.4,11.5 180 top
C10  83.4,9.8 180 top
C11  7.4,12.4 0 top
C12  7.8,5.7 0 top
C13  139.6,18.4 0 top
C14  33.4,7.7 270 top
C15  13.8,3.2 180 top
C16  14.7,14.2 180 top
C17  120.6,22.8 0 top
C18  116.7,23.2 0 top
C19  112.4,19.6 0 top
C20  117.8,4.8 90 top
C21  137.3,22.2 0 top
C22  12.5,20.4 0 top
D1  4.3,29.3 90 top
D2  4.2,21.2 270 top
D3  127.3,3.1 0 top
DGT1  15.14,56.16 0 top
DGT2  35.09,56.16 0 top
DGT3  63.04,56.16 0 top
DGT4  83.14,56.21 0 top
DGT5  111.09,56.21 0 top
DGT6  131.04,56.21 0 top
F1  6.6,35.8 0 top
GT1  49.1,56.2 180 top
GT2  97.2,56.2 180 top
IC1  26,9.9 90 top
IC2  12.7,8.8 180 top
IC3  126.5,22.1 270 top
K1  73.4,72.7 0 top
K2  73.4,3.3 180 bottom
K3  106.5,16.1 270 top
K4  18.2,25.4 180 top
K5  50.2,31.4 180 top
K6  71.3,32.9 0 top
K7  69.4,32.9 0 top
K8  67.5,32.9 0 top
L1  137.8,8.2 90 top
P1  78.8,32.4 0 top
P2  19.7,18.5 0 top
P3  19.7,21 0 top
P4  29.8,28.3 270 bottom
R1  25.37,45.6 270 top
R2  35.6,9.3 270 top
R3  6.92,48.67 270 top
R4  7.02,52.25 270 top
R5  8.02,59.73 270 top
R6  116.7,21.6 0 top
R7  51,45.6 270 top
R8  47.6,45.5 270 top
R9  98.9,45.5 270 top
R10  95.8,45.5 270 top
R11  112.4,18.1 180 top
R12  23.52,58.91 270 top
R13  36.07,45.56 270 top
R14  112.4,16.6 180 top
R15  31.31,47.02 0 top
R16  27.02,52.57 270 top
R17  26.82,59.05 270 top
R18  27.42,63.13 270 top
R19  29.22,64.61 270 top
R20  38.29,65.38 180 top
R21  41.02,63.37 270 top
R22  42.82,63.25 270 top
R23  42.78,50.27 90 top
R24  40.21,47.78 180 top
R25  64.47,45.52 270 top
R26  111.6,13.3 90 top
R27  59.23,47.03 0 top
R28  54.83,52.45 270 top
R29  54.63,59.73 270 top
R30  55.43,63.21 270 top
R31  57.23,64.69 270 top
R32  66.37,65.37 180 top
R33  68.83,63.25 270 top
R34  70.43,63.33 270 top
R35  70.77,50.79 90 top
R36  68.29,47.97 180 top
R37  84.47,45.48 270 top
R38  116.9,16.7 90 top
R39  79.23,47.03 0 top
R40  74.83,52.65 270 top
R41  74.93,59.73 270 top
R42  75.83,63.41 270 top
R43  77.44,64.77 270 top
R44  86.25,64.06 180 top
R45  89.84,62.83 270 top
R46  91.31,57.16 180 top
R47  91.16,50.91 90 top
R48  88.37,48.16 180 top
R49  112.47,45.44 270 top
R50  115.9,10.3 0 top
R51  106.95,47.24 0 top
R52  103.04,52.53 270 top
R53  102.84,59.81 270 top
R54  102.91,62.24 0 top
R55  105.14,64.37 270 top
R56  113.85,65.36 180 top
R57  117.04,62.53 270 top
R58  118.84,62.41 270 top
R59  120.55,52.93 90 top
R60  116.45,47.95 180 top
R61  132.47,45.4 270 top
R62  115.9,12.2 0 top
R63  126.47,47.05 0 top
R64  123.05,52.81 270 top
R65  122.65,59.49 270 top
R66  125.15,65.07 270 top
R67  127.95,65.35 270 top
R68  133.93,65.35 180 top
R69  137.05,62.41 270 top
R70  138.85,62.29 270 top
R71  139.35,51.03 90 top
R72  136.65,48.15 180 top
R73  51.3,64 270 top
R74  93.9,63.3 0 top
R75  115.9,14 0 top
R76  132.2,22.7 180 top
S1  101.5,35.4 180 top
S2  116.5,35.4 180 top
S3  131.5,35.4 180 top
T1  9.89,48.16 180 top
T2  9.86,52.13 90 top
T3  8.36,56.05 90 top
T4  48.9,60.8 0 top
T5  95.9,59.5 90 top
T6  124.2,12.6 270 top
T10  22.67,54.34 0 top
T11  32.61,49.86 180 top
T12  29.86,52.31 90 top
T13  28.36,55.73 90 top
T14  29.36,59.65 90 top
T15  31.86,62.07 90 top
T16  34.99,63.64 0 top
T17  38.19,62.24 270 top
T18  41.19,59.32 270 top
T19  41.69,53.9 270 top
T20  39.98,51.31 180 top
T21  60.56,49.81 180 top
T22  57.81,52.36 90 top
T23  56.31,55.78 90 top
T24  57.31,59.7 90 top
T25  59.81,62.12 90 top
T26  63.04,63.69 0 top
T27  66.19,62.04 270 top
T28  69.19,59.12 270 top
T29  69.69,54.2 270 top
T30  67.78,51.31 180 top
T31  80.74,49.96 180 top
T32  77.96,52.18 90 top
T33  76.46,56.1 90 top
T34  77.46,60.02 90 top
T35  79.96,62.44 90 top
T36  83.26,63.04 0 top
T37  86.44,61.82 270 top
T38  89.54,59.3 270 top
T39  90.04,54.38 270 top
T40  87.96,51.46 180 top
T41  108.54,49.96 180 top
T42  105.96,51.88 90 top
T43  104.46,56.3 90 top
T44  105.46,59.72 90 top
T45  107.61,62.26 90 top
T46  110.68,63.89 0 top
T47  114.39,62.4 270 top
T48  117.39,58.48 270 top
T49  117.89,54.06 270 top
T50  116.14,51.11 180 top
T51  128.22,49.61 180 top
T52  125.61,52.2 90 top
T53  124.61,56.12 90 top
T54  125.11,59.54 90 top
T55  127.61,61.96 90 top
T56  130.88,63.39 0 top
T57  134.39,62.2 270 top
T58  136.89,58.28 270 top
T59  137.74,54.24 270 top
T60  136.32,51.26 180 top
U1  73.53,19.54 180 top
U2  5,9 90 top

### Tracks (layer width: path | path; a pad name or v marks a point on that pad's centre or on a via)
+3V3
  Top 0.406: IC2.1 15.49,12.43 C16.1 15.49,15.29 17.5,17.3 17.5,19.56 P3.1
+5V
  Top 0.305: C6.1 64.15,18.54 U1.65 68.76,18.54 | U1.100 79.71,11.49 81.5,9.7 82.51,9.7 C10.2 82.6,9.81 82.6,11.4 82.5,11.5 | U1.88 73.53,12.63 74,13.1 | 74,13.1 79.8,13.1 81.4,11.5 82.5,11.5 | 82.5,11.5 C9.2 | C7.1 63.5,11.56 U1.75 66.34,13.54 67.2,14.4 68.8,14.4 | C2.1 74.03,29.54 U1.37 74.03,26.53 73.5,26 72.6,26 72.2,25.6 72.2,23.6 | C4.1 67.42,27.7 U1.50 67.53,26.47 68.76,25.24 68.76,23.3 | 68.8,14.4 73.4,14.4 74,13.8 74,13.1 | 68.76,18.54 68.8,18.5 68.8,14.4 | 68.76,18.54 68.76,23.3 | K3.1 103.28,11.02 87.9,26.4 82.6,26.4 82.41,26.59 C1.1 U1.26 79.53,25.93 78.9,25.3 77.6,25.3 75.9,23.6 72.2,23.6 | 72.2,23.6 69.06,23.6 68.76,23.3
+5VP  (via drill 0.6)
  Top 0.305: 17.9,2.9 27.2,2.9 28.1,3.8 28.1,7.6 29.13,8.63 IC1.4 31.05,8.49 C14.1 35.58,8.49 R2.2 | 14.89,2.9 C15.1
  Top 0.406: 8.3,7.5 8.8,8 14.6,8 14.61,8 IC2.8 14.61,3.22 C15.1 | P2.1 18.94,16.44 v17.9,15.4 | v17.9,4 17.9,2.9
  Top 0.61: 17.9,2.9 14.89,2.9
  Top 0.813: U2.1 8.3,7.5 8.6,7.2 8.6,5.71 C12.2
  Bottom 0.406: v17.9,15.4 v17.9,4
+12V  (via drill 0.6, 0.8)
  Top 0.305: IC3.8 132.59,24 132.6,24
  Top 0.61: L1.P$2 136.87,12.77 136.8,12.7 136.8,18.15 C13.+ 136.55,22.16 C21.1 136.5,22.21 136.5,24.1 | IC3.8 136.41,24 136.5,24.1 | 136.5,24.1 v136.5,24.9 | v7.2,24 7.2,23.65 6.9,23.35
  Top 0.813: D1.K 4.23,27.11 D2.K 6.9,23.35 7.25,23.35 9.8,20.8 9.8,20.75 C22.+ 9.4,20.35 9.4,15.9 8.19,14.69 C11.2 8.19,10.79 7.9,10.5 U2.3
  Bottom 0.61: v136.5,24.9 136.4,25 136.4,28.4 133.9,30.9 96.7,30.9 93.5,34.1 93.5,37.2 92,38.7 53.7,38.7 51.2,36.2 49.2,36.2 46.8,38.6 13.7,38.6 11.8,36.7 11.8,34 9,31.2 9,25.8 v7.2,24
A0
  Top 0.305: K1.4 40.38,71.18 38.6,69.4 27.3,69.4 23.52,65.62 R12.1
A0P
  Top 0.305: K2.4 40.8,4.99 40.8,6.5 63.6,29.3 68,29.3 68.53,28.77 U1.48
A1
  Top 0.305: K1.1 37.81,74 37.1,74 34.6,71.5 23,71.5 16.8,65.3 9.8,65.3 5.6,61.1 5.6,50.78 R3.1
A1P
  Top 0.305: K2.1 37.27,2.6 36.8,2.6 36.2,3.2 36.2,5.8 37.5,7.1 38.6,7.1 62.6,31.1 68.6,31.1 70.03,29.67 U1.45
A2
  Top 0.305: R4.1 6.3,53.76 6.3,60.8 10.1,64.6 17.1,64.6 23.3,70.8 37.21,70.8 K1.2
A2P
  Top 0.305: K2.2 38.6,5.33 38.6,6.1 63,30.5 68.4,30.5 69.53,29.37 U1.46
A3
  Top 0.305: K1.3 39.1,72.69 39.1,70.8 38.3,70 23.5,70 17.4,63.9 11.4,63.9 R5.1
A3P
  Top 0.305: K2.3 40.27,2.03 39.2,3.1 39.2,5.8 63.3,29.9 68.2,29.9 69.03,29.07 U1.47
B0
  Top 0.305: R24.1 43.18,47.78 44.4,49 44.4,58.5 45.4,59.5 45.4,61.4 53.08,69.08 K1.14
B0P
  Top 0.305: U1.69 62.74,16.54 53.3,7.1 53.3,4.79 K2.14
B1
  Top 0.305: R15.1 29.68,47.02 25.1,51.6 25.1,65.9 28,68.8 39.2,68.8 39.7,69.4 40.7,69.4 41.7,70.4 41.7,72.6 42.92,73.82 K1.5
B1P
  Top 0.305: K2.5 42.77,2.03 41.7,3.1 41.7,6.5 63.9,28.7 67.7,28.7 68.03,28.37 U1.49
B2
  Top 0.305: R16.1 25.7,54.68 25.7,65.5 28.4,68.2 39.5,68.2 40,68.8 42.1,68.8 42.92,69.62 K1.6
B2P
  Top 0.305: U1.51 61.64,25.54 43.4,7.3 43.4,5.05 K2.6
B3
  Top 0.305: R17.1 26.3,60.36 26.3,65.3 28.7,67.6 39.8,67.6 40.3,68.1 43,68.1 44.2,69.3 44.2,72.8 45.37,73.97 K1.7
B3P
  Top 0.305: U1.52 62.14,25.04 44.2,7.1 44.2,3.1 45.27,2.03 K2.7
B4
  Top 0.305: R18.1 27.42,65.42 29.1,67 40.3,67 40.7,67.4 43.6,67.4 45.46,69.26 K1.8
B4P
  Top 0.305: U1.53 62.54,24.54 45.9,7.9 45.9,5.01 K2.8
B5
  Top 0.305: R19.1 32.8,65.4 33.8,66.4 40.7,66.4 40.9,66.6 44.6,66.6 46.7,68.7 46.7,72.4 48,73.7 K1.9
B5P
  Top 0.305: U1.54 62.94,24.04 46.8,7.9 46.8,3.3 48,2.1 K2.9
B6
  Top 0.305: R20.1 41.08,65.38 41.5,65.8 45,65.8 48,68.8 K1.10
B6P
  Top 0.305: U1.55 63.44,23.54 48.4,8.5 48.4,4.97 K2.10
B7
  Top 0.305: R21.1 42.06,65.2 45.6,65.2 49.3,68.9 49.3,72.5 50.54,73.74 K1.11
B7P
  Top 0.305: U1.56 63.94,23.04 49.3,8.4 49.3,3.2 50.47,2.03 K2.11
B8
  Top 0.305: R22.1 45.74,64.04 50.4,68.7 50.4,71.29 K1.12
B8P
  Top 0.305: U1.67 61.94,17.54 50.5,6.1 50.5,4.61 K2.12
B9
  Top 0.305: R23.1 43.58,49.48 43.8,49.7 43.8,58.8 44.8,59.8 44.8,62.1 51.8,69.1 51.8,72.7 K1.13
B9P
  Top 0.305: U1.68 62.34,17.04 51.8,6.5 51.8,3.2 52.97,2.03 K2.13
C0
  Top 0.305: K1.25 67.1,72.75 67.1,69.9 67.8,69.2 68.2,69.2 72.7,64.7 72.7,57.5 72.5,57.3 72.5,49.9 70.57,47.97 R36.1
C0P
  Top 0.305: K2.25 67.1,3.25 67.1,5.4 70.03,8.33 U1.81
C1
  Top 0.305: R27.1 55.37,50.1 54.3,50.1 52.9,51.5 52.9,66.1 55.62,68.82 K1.16
C1P
  Top 0.305: U1.71 63.54,15.54 55.9,7.9 55.9,4.85 K2.16
C2
  Top 0.305: R28.1 53.6,54.47 53.6,65.8 56.9,69.1 56.9,72.4 58.16,73.66 K1.17
C2P
  Top 0.305: U1.72 63.94,15.04 56.9,8 56.9,3.3 K2.17
C3
  Top 0.305: R29.1 54.4,60.75 54.4,65.6 56.3,67.5 57,67.5 58.16,68.66 K1.18
C3P
  Top 0.305: U1.73 64.34,14.54 58.3,8.5 58.3,4.71 K2.18
C4
  Top 0.305: R30.1 55.43,65.33 56.8,66.7 57.6,66.7 59.4,68.5 59.4,72.4 60.7,73.7 K1.19
C4P
  Top 0.305: U1.74 64.74,14.04 59.4,8.7 59.4,3.3 60.67,2.03 K2.19
C5
  Top 0.305: R31.1 57.85,66.1 59.3,66.1 60.7,67.5 K1.20
C5P
  Top 0.305: U1.76 67.53,10.13 65.6,8.2 64.1,8.2 62.8,6.9 62.2,6.9 61.3,6 61.3,5.17 K2.20
C6
  Top 0.305: R32.1 66.03,66.5 63.2,66.5 62,67.7 62,72.6 63.24,73.84 K1.21
C6P
  Top 0.305: U1.77 68.03,9.73 65.8,7.5 64.3,7.5 63,6.2 62.5,6.2 62,5.7 62,3.27 K2.21
C7
  Top 0.305: R33.1 68.83,65.47 67.2,67.1 63.7,67.1 63.24,67.56 K1.22
C7P
  Top 0.305: U1.78 68.53,9.43 65.9,6.8 64.9,6.8 63.6,5.5 63.6,4.93 K2.22
C8
  Top 0.305: R34.1 70.43,64.67 67.4,67.7 65.1,67.7 64.5,68.3 64.5,72.7 K1.23
C8P
  Top 0.305: U1.79 69.03,9.13 66,6.1 65.2,6.1 64.5,5.4 64.5,3.2 65.67,2.03 K2.23
C9
  Top 0.305: R35.1 71.4,50 71.7,50.3 71.7,58.2 72,58.5 72,64.4 67.9,68.5 66.2,68.5 65.8,68.9 65.8,71.41 K1.24
C9P
  Top 0.305: U1.80 69.53,8.73 66.4,5.6 66.4,5.19 K2.24
CLK  (via drill 0.6)
  Top 0.305: U1.21 79.5,23.54 v79.4,23.3
  Bottom 0.305: K3.4 104.84,20.3 92.4,20.3 90.7,22 81,22 79.7,23.3 v79.4,23.3
CS  (via drill 0.6)
  Top 0.305: IC1.1 31.68,4.82 32.7,3.8 34.3,3.8 34.7,4.2 34.7,5.6 39.9,10.8 39.9,17.8 41,18.9 v41.5,18.9 | U1.36 74.53,26.23 v73.2,24.9
  Bottom 0.305: v73.2,24.9 71.4,23.1 59.6,23.1 57.6,21.1 47.2,21.1 45,18.9 v41.5,18.9
D0
  Top 0.305: K1.35 79.7,72.65 79.7,70.5 82.6,67.6 89.2,67.6 92.1,64.7 92.1,62.5 93.7,60.9 93.7,50.3 91.56,48.16 R48.1
D0P
  Top 0.305: U1.94 76.53,8.37 78.7,6.2 79.1,6.2 79.7,5.6 79.7,3.35 K2.35
D1
  Top 0.305: K1.26 68.32,70.48 73.3,65.5 73.3,51.6 77.87,47.03 R39.1
D1P
  Top 0.305: 68.5,5.3 68.5,4.75 K2.26 68.32,5.42 70.53,7.63 U1.82
D2
  Top 0.305: R40.1 74.3,53.97 74.3,56.9 73.9,57.4 73.9,61.2 74.1,61.5 74.1,66.2 69.6,70.7 69.6,72.71 K1.27
D2P
  Top 0.305: U1.83 71.03,6.83 69.6,5.4 69.6,3.3 K2.27
D3
  Top 0.305: K1.28 71.1,71.19 71.1,70.5 74.93,66.67 R41.1 74.83,60.52
D3P
  Top 0.305: U1.84 71.53,5.24 K2.28
D4
  Top 0.305: K1.29 72.2,72.77 72.2,70.6 75.83,66.97 R42.1
D4P
  Top 0.305: U1.85 72.03,5.67 72.1,5.6 72.1,3.33 K2.29
D5
  Top 0.305: K1.30 73.4,70.4 77.44,66.36 R43.1
D5P
  Top 0.305: U1.89 74.03,5.2 K2.30
D6
  Top 0.305: K1.31 75.94,73.74 74.7,72.5 74.7,70.6 80.1,65.2 86.4,65.2 87.04,64.56 R44.1
D6P
  Top 0.305: U1.90 74.53,5.87 74.7,5.7 74.7,3.3 75.94,2.06 K2.31
D7
  Top 0.305: K1.32 75.94,70.56 80.7,65.8 88.2,65.8 89.84,64.16 R45.1
D7P
  Top 0.305: U1.91 75.03,6.27 75.9,5.4 75.9,4.61 K2.32
D8
  Top 0.305: K1.33 78.48,73.78 77.2,72.5 77.2,70.8 81.6,66.4 88.8,66.4 90.9,64.3 90.9,61.7 92.1,60.5 R46.1
D8P
  Top 0.305: U1.92 75.53,7.37 77.2,5.7 77.2,3.1 78.27,2.03 K2.33
D9
  Top 0.305: K1.34 78.48,70.82 82.3,67 89,67 91.5,64.5 91.5,62.1 93,60.6 93,51.4 91.72,50.12 R47.1
D9P
  Top 0.305: U1.93 76.03,7.97 78.5,5.5 78.5,4.59 K2.34
DEC1
  Top 0.305: K1.15 54.3,72.65 54.3,68.9 51.3,65.9 R73.1
DEC1P
  Top 0.305: U1.70 63.14,16.04 54.4,7.3 54.4,3.3 55.62,2.08 K2.15
DEC2
  Top 0.305: K1.36 81.02,70.48 83.3,68.2 89.4,68.2 93.11,64.49 R74.1
DEC2P
  Top 0.305: U1.95 77.03,9.17 81.1,5.1 81.1,4.65 K2.36
E0  (via drill 0.6)
  Top 0.305: K1.46 93.7,71.41 93.7,69.1 94.9,67.9 97.8,67.9 99.4,66.3 v99.4,64.3 | 117.49,47.7 R60.1 118.35,47.95 v119.5,49.1
  Bottom 0.305: v99.4,64.3 99.4,61.3 101.3,59.4 101.3,51.3 104.3,48.3 118.7,48.3 v119.5,49.1
E0P
  Top 0.305: U1.6 86.46,16.04 93.72,8.78 K2.46
E1
  Top 0.305: K1.37 83.47,73.97 82.3,72.8 82.3,70.3 83.8,68.8 89.7,68.8 93.8,64.7 95.3,64.7 95.8,64.2 95.8,62.1 97.3,60.6 98.6,60.6 100.5,58.7 100.5,51.1 104.3,47.3 106.1,47.3 R51.1
E1P
  Top 0.305: U1.96 77.53,9.47 80.8,6.2 81.5,6.2 82.3,5.4 82.3,3.5 83.56,2.24 K2.37
E2
  Top 0.305: K1.38 83.56,70.04 84.2,69.4 90,69.4 94.1,65.3 95.7,65.3 96.5,64.5 96.5,62.5 97.7,61.3 99.2,61.3 101.5,59 101.5,54.86 R52.1
E2P
  Top 0.305: U1.97 78.03,9.87 81,6.9 81.7,6.9 83.2,5.4 83.2,4.93 K2.38
E3
  Top 0.305: K1.39 86.07,73.97 84.8,72.7 84.8,70.5 85.3,70 90.3,70 94.4,65.9 96,65.9 97.3,64.6 97.3,63 98.1,62.2 99.7,62.2 101.3,60.6 102.64,60.6 R53.1
E3P
  Top 0.305: U1.98 78.53,10.17 81.2,7.5 82.9,7.5 84.8,5.6 84.8,3.3 86.07,2.03 K2.39
E4
  Top 0.305: K1.40 86.13,71.43 87.4,72.7 91.9,72.7 92.5,72.1 92.5,68.8 94.7,66.6 96.3,66.6 98,64.9 98,63.3 98.4,62.9 101.4,62.9 102.06,62.24 R54.1
E4P
  Top 0.305: U1.99 79.03,10.47 81.4,8.1 83.2,8.1 85.9,5.4 85.9,4.77 K2.40
E5  (via drill 0.6)
  Top 0.305: v103,64.3 103.86,65.16 R55.1
  Bottom 0.305: K1.41 87.4,72.73 87.4,69.5 90.4,66.5 102.5,66.5 103,66 v103,64.3
E5P
  Top 0.305: U1.1 84.86,13.54 87.4,11 87.4,3.2 88.57,2.03 K2.41
E6  (via drill 0.6)
  Top 0.305: v116.2,65 115,65 R56.1
  Bottom 0.305: K1.42 88.7,71.37 88.7,69.9 91.5,67.1 115.3,67.1 116.2,66.2 v116.2,65
E6P
  Top 0.305: U1.2 85.16,14.04 88.64,10.56 K2.42
E7  (via drill 0.6)
  Top 0.305: v117.9,65.1 117.7,64.6 117.3,64.2 117.3,63.58 R57.1
  Bottom 0.305: K1.43 89.9,72.69 89.9,70.7 92.9,67.7 117,67.7 117.9,66.8 v117.9,65.1
E7P
  Top 0.305: U1.3 85.56,14.54 89.9,10.2 89.9,3.2 91.07,2.03 K2.43
E8  (via drill 0.6)
  Top 0.305: v119.6,64.8 118.84,64.04 R58.1
  Bottom 0.305: K1.44 94.31,68.3 118.2,68.3 120.2,66.3 120.2,65.4 v119.6,64.8
E8P
  Top 0.305: U1.4 85.86,15.04 91.1,9.8 91.1,4.65 K2.44
E9  (via drill 0.6)
  Top 0.305: K1.45 95,72.69 95,70.2 96.2,69 98.5,69 100.8,66.7 v100.8,64.3 | v119.1,50.9 119.31,50.9 R59.1
  Bottom 0.305: v100.8,64.3 100.8,61 102.2,59.6 102.2,51.5 104.6,49.1 117.3,49.1 v119.1,50.9
E9P
  Top 0.305: U1.5 86.16,15.54 92.5,9.2 92.5,3.1 93.57,2.03 K2.45
F0
  Top 0.305: K1.56 107.75,70.1 136.2,70.1 141,65.3 141,53.6 141.3,53.3 141.3,49.9 139.6,48.2 137.49,48.2 R72.1
F0P
  Top 0.305: U1.25 87.36,25.54 106.3,6.6 106.3,4.69 K2.56
F1  (via drill 0.6)
  Top 0.305: v124.3,49.2 125.68,47.82 R63.1
  Bottom 0.305: K1.47 95,72.71 95,70.7 96.8,68.9 119.1,68.9 121.3,66.7 121.3,58.7 123,57 123,54 124.3,52.7 v124.3,49.2
F1P
  Top 0.305: U1.7 86.86,16.54 95,8.4 95,3.1 96.07,2.03 K2.47
F2  (via drill 0.6)
  Top 0.305: v122.6,65 121.5,63.9 121.5,55.2 123.05,53.65 R64.1
  Bottom 0.305: K1.48 98.19,69.5 123.3,69.5 124.5,68.3 124.5,66.9 v122.6,65
F2P
  Top 0.305: U1.8 87.16,17.04 96.1,8.1 96.1,4.73 K2.48
F3  (via drill 0.6)
  Top 0.305: R65.1 122.65,62.45 v123.5,63.3
  Bottom 0.305: K1.49 100.1,72.67 100.1,70.6 100.6,70.1 124.3,70.1 125.9,68.5 125.9,65.7 v123.5,63.3
F3P
  Top 0.305: U1.9 87.56,17.54 97.5,7.6 97.5,3.1 98.57,2.03 K2.49
F4
  Top 0.305: K1.50 98.8,70 102.3,66.5 124.51,66.5 R66.1
F4P
  Top 0.305: U1.16 85.36,21.04 98.8,7.6 K2.50
F5
  Top 0.305: K1.51 100.1,72.73 100.1,70.1 103.1,67.1 126.99,67.1 R67.1
F5P
  Top 0.305: U1.17 85.86,21.54 100.1,7.3 100.1,3.1 101.17,2.03 K2.51
F6
  Top 0.305: K1.52 101.3,71.39 101.3,70.2 103.8,67.7 132.37,67.7 R68.1
F6P
  Top 0.305: U1.18 86.26,22.04 101.4,6.9 101.4,4.63 K2.52
F7
  Top 0.305: K1.53 102.6,72.69 102.6,70.4 104.7,68.3 133.8,68.3 136.9,65.2 136.9,63.35 R69.1
F7P
  Top 0.305: U1.19 86.66,22.54 102.6,6.6 102.6,3.31 K2.53
F8
  Top 0.305: K1.54 104.1,71.21 104.1,70.2 105.4,68.9 134.6,68.9 138.7,64.8 138.7,63.23 R70.1
F8P
  Top 0.305: U1.22 87.06,24.04 103.8,7.3 103.8,4.65 K2.54
F9
  Top 0.305: K1.55 105.2,72.75 105.2,70.6 106.3,69.5 135.6,69.5 140.1,65 140.1,53.3 140.6,52.8 140.6,50.8 140,50.2 139.39,50.2 R71.1
F9P
  Top 0.305: U1.24 86.96,25.04 105.1,6.9 105.1,3.3 106.37,2.03 K2.55
GND  (via drill 0.6)  (1 unrouted)
  Top 0.305: 109,73.93 109,71.2 109.2,71.4 136.1,71.4 141.8,65.7 141.8,54.1 142.4,53.5 142.4,49.6 139,46.2 135.8,46.2 | T4.2 47.96,62.26 v49.1,63.4 | T5.2 95,58.44 v95,57.1 | T1.2 11.5,47.81 v11.5,48.4 | T10.2 21.8,55.43 v21.8,56.8
  Top 0.406: T3.2 7.5,55.11 8.01,54.6 v8.8,54.6 | T2.2 9.23,50.8 v10.4,50.8 | T15.2 30.57,61.4 v29.8,61.4 | v29.8,58.2 29.29,58.71 T14.2 | v28.8,54.6 28.61,54.79 T13.2 | v30.6,51 30.23,51.37 T12.2 | v34,50.4 33.55,49.95 T11.2 | v41.4,51.8 40.92,51.32 T20.2 | v41.6,55.4 42.16,54.84 T19.2 | v33.6,63.4 34.05,63.85 T16.2 | T17.2 38.79,63.6 v37.8,63.6 | T18.2 41.87,60.6 v40.8,60.6 | v61.8,63.4 62.1,63.7 T26.2 | v57.8,61.8 58.42,61.18 T25.2 | T24.2 56.85,58.2 v57.4,58.2 | T23.2 55.53,54.6 v56.6,54.6 | T22.2 57.21,51 v58.2,51 | T21.2 61.8,49.09 v61.8,50.2 | T30.2 69,50.57 v69,51.8 | T29.2 70.05,55.8 v69.4,55.8 | T28.2 69.87,60.4 v68.8,60.4 | T27.2 66.79,63.4 v65.8,63.4 | T33.2 76,54.6 v76.8,54.6 | T32.2 77.38,50.8 v78.4,50.8 | T31.2 82.2,49.46 v82.2,50.4 | T39.2 90.58,55.8 v89.8,55.8 | T40.2 89.4,50.94 v89.4,51.8 | v89.4,60.6 89.76,60.24 T38.2 | T34.2 77.12,58.4 v77.6,58.4 | T35.2 78.44,62 v77.8,62 | v104.6,54.6 103.84,55.36 T43.2 | v105.6,58 104.82,58.78 T44.2 | T45.2 105.91,62 v105.6,62 | v109.4,63.6 109.74,63.94 T46.2 | T47.2 114.95,63.8 v114,63.8 | T48.2 117.83,60 v117,60 | T49.2 118.31,55.6 v117.6,55.6 | T50.2 117.4,50.41 v117.4,51.6 | T41.2 110,49.46 110,50.3 v110.4,50.7 | T42.2 105.28,50.6 v106.4,50.6 | T60.2 137.6,50.58 v137.6,51.8 | T51.2 129.8,49.23 v129.8,50.2 | T52.2 125.05,50.8 v126.2,50.8 | T53.2 124.17,54.6 v124.6,54.6 | T54.2 124.49,58.2 v125.6,58.2 | v125.4,61.8 126.18,61.02 T55.2 | T56.2 129.6,64.07 v129.6,63 | T57.2 134.95,63.6 v133.8,63.6 | T58.2 137.53,59.6 v136.6,59.6 | T59.2 138.34,55.6 v137.4,55.6 | v81.1,64.2 81.24,64.06 T36.2 | T37.2 v88.4,63.7
  pour Bottom (isolate 0.813): 6,75 5,74 5,47 6,46 11.3,46 arc90 12.7,47.4 12.7,50.2 arc-90 13.4,50.9 23,50.9 arc-90 24,49.9 24,46.9 arc90 24.9,46 140.5,46 142,47.5 142,73.5 140.5,75
GND2  (via drill 0.6)
  Top 0.305: U1.87 73.03,9 v73.1,9 | 83.14,18.04 U1.10 83.54,18.04 83.8,18.3 v83.8,19.2 | U1.12 83.64,19.04 v83.8,19.2 | U1.13 83.46,19.54 v83.8,19.2 | U1.14 83.56,20.04 83.8,19.8 v83.8,19.2 | C5.2 C6.2 61.2,18.6 v61.1,18.5 | C8.1 C7.2 62.61,9.61 v61.7,8.7 | v85.8,10.1 85.5,9.8 C10.1 C9.1 | C1.2 85.4,27.6 v85.5,27.7 | U1.38 73.53,32.57 v73.4,32.7 | C4.2 v63.5,26.7 | C3.2 72.6,32.5 72.8,32.7 v73.4,32.7 | C2.2 74.5,32.4 74.3,32.6 73.5,32.6 v73.4,32.7 | U1.66 66.56,18.04 v67.4,17.2 | U1.64 66.84,19.04 v67.5,19.7 | K2.58 109,4.61 109,22.3 | K5.GND_RS232 50.21,25.91 v50.2,25.9 | C14.2 v33.4,5.7
  Top 0.406: IC3.4 121.3,20.2 v120.4,19.3 120.1,19 114.4,19 113.8,19.6 C19.2 R11.1 R14.1 | C18.1 R6.1 115.9,21.61 115.9,23.3 v114.7,23.3
  Top 0.61: K2.60 111.6,4.67 | R75.1 R62.1 R50.1 115,10.26 115,7.9 115.35,7.55 115.51,7.39 C20.2 | C21.2 141,22.2 142.5,20.7 142.5,18.55 C13.- v144.5,18.4 v144.5,17.2 v144.5,19.6 | IC3.5 v127,20.2 | R76.1 134.3,22.7 v134.6,22.4 | IC1.15 16.93,11.17 16.9,11.2 16.9,10.5 15.8,9.4 v13.5,9.4
  Top 0.813: 111.6,4.67 112.47,4.67 115.35,7.55 | D2.A 4.3,18.89 v4.3,12.4 | C22.- 15.55,18.25 v15.9,17.9 13.6,17.9 13.5,18 | 5.8,9 U2.2 8,9
  Bottom 0.305: v50.2,25.9 50.2,25.6 | v33.4,5.7 34,5.5
  Bottom 0.406: v120.4,19.3 120.4,19.4 120.3,19.5 | v114.7,23.3 114.6,23.4 114.4,23.4
  Bottom 0.61: v127,20.2 126.8,20.2 126.6,20.4 | v134.6,22.4 134.6,22
  other vias: 5.5,12.4 3.1,12.4 1.9,12.4 1.9,11 1.9,7.1 1.9,5.7 3.2,5.7 4.5,5.7 5.8,5.7 11.6,9.4 13.5,17.9 14.7,17.9 36,27 39,27 42,15 72,18 75,18 75,21
  pour Bottom (isolate 0.813): 1,3 3,1 143,1 146,4 146,36 143,39 3,39 1,37
  pour Top (isolate 0.813): 1,3 3,1 108,1 109,2 109,24 112,27 143,27 146,30 146,36 143,39 3,39 1,37
INT_1S  (via drill 0.6)
  Top 0.305: IC1.5 33.5,9.9 33.69,10.09 R2.1 35.79,10.09 38.8,13.1 38.8,18.5 40.2,19.9 v42.5,19.9 | U1.33 76.03,28.37 v75.5,28.9
  Bottom 0.305: v75.5,28.9 74.9,28.9 70.1,24.1 59.1,24.1 57.1,22.1 46.9,22.1 44.7,19.9 v42.5,19.9
MISO  (via drill 0.6)
  Top 0.305: IC1.19 23.79,6.09 26.8,9.1 26.8,19.6 28.3,21.1 44.1,21.1 v46.8,18.4 | U1.34 75.53,25.67 v75.9,25.3
  Bottom 0.305: v75.9,25.3 75.9,24.7 72.6,21.4 60.5,21.4 57.5,18.4 v46.8,18.4
MOSI  (via drill 0.6)
  Top 0.305: IC1.17 23.13,8.63 24.8,10.3 24.8,20.5 27.6,23.3 v46.4,23.3 | U1.32 76.53,31.47 v76,32
  Bottom 0.305: v46.4,23.3 56.9,23.3 58.7,25.1 69.8,25.1 76,31.3 v76,32
N$1
  Top 0.305: T1.3 10.19,49.5 10.9,49.5 12.4,51 12.4,51.8 12.76,52.16 DGT1.K1
N$2
  Top 0.406: T2.3 11.44,52.72 DGT1.K2
N$3
  Top 0.406: T3.3 10.29,55.16 DGT1.K3
N$4
  Top 0.305: GT1.A1 51,54.3 R7.1
N$5
  Top 0.305: GT1.A2 47.6,54.7 R8.1
N$6
  Top 0.305: GT2.A1 98.9,54.5 R9.1
N$7
  Top 0.305: GT1.K 48.92,58.28 T4.3
N$8
  Top 0.305: T5.3 97.2,59.24 GT2.K
N$9
  Top 0.305: R74.2 94.88,63.1 T5.1
N$10
  Top 0.305: T10.3 22.56,53.46 DGT1.K0
N$11
  Top 0.305: GT2.A2 95.8,54.8 R10.1
N$12
  Top 0.406: DGT1.A 18.1,51.5 23.1,51.5 24.8,49.8 24.8,48.9 25.37,48.33 R1.1
N$13
  Top 0.305: R3.2 7.66,47.14 T1.1
N$14
  Top 0.406: R4.2 7.46,51.46 8.6,52.6 8.6,52.88 T2.1
N$15
  Top 0.406: T3.1 7.34,58.27 R5.2
N$16
  Top 0.305: T4.1 49.9,61.82 R73.2
N$17
  Top 0.813: K4.+ 17.4,24.6 11.1,24.6 8.71,26.99 F1.A
N$18
  Top 0.813: F1.K 4.24,35.79 D1.A
N$19
  Top 0.305: U1.39 73.03,29.58 C3.1
N$21
  Top 0.305: P1.2 79.3,32.66 79.3,33.6 78.1,34.8 63.8,34.8 56.5,27.5 54.9,27.5 K5.TX_RS232
  Top 0.406: P2.2 P3.2 20.46,22.16 22.6,24.3 22.6,32.9 25.6,35.9 51.7,35.9 53.6,34 53.6,28.97 K5.TX_RS232
N$22
  Top 0.305: T10.1 23.52,55.5 R12.2
N$23
  Top 0.406: T11.3 32.79,51.08 DGT2.K1
N$24
  Top 0.406: T12.3 31.39,52.85 DGT2.K2
N$25
  Top 0.406: T13.3 29.97,55.16 DGT2.K3
N$26
  Top 0.406: T14.3 30.99,59.06 DGT2.K4
N$27
  Top 0.406: T15.3 33.09,61.88 DGT2.K5
N$28
  Top 0.406: T16.3 35.09,62.55 DGT2.K6
N$29
  Top 0.406: T17.3 37.09,62.13 DGT2.K7
N$30
  Top 0.406: T18.3 39.94,59.06 DGT2.K8
N$31
  Top 0.406: T19.3 39.59,54.96 DGT2.K9
N$32
  Top 0.406: T20.3 38.82,53.46 DGT2.K0
N$33
  Top 0.305: U1.63 64.55,19.54 C5.1
N$34
  Top 0.406: DGT2.A 36.07,50.84 R13.1
N$35
  Top 0.406: T11.1 32.1,48.37 R15.2
N$36
  Top 0.406: R16.2 27.38,51.78 28.4,52.8 28.4,52.86 T12.1
N$37
  Top 0.406: R17.2 26.82,57.24 T13.1
N$38
  Top 0.406: R18.2 27.42,61.56 T14.1
N$39
  Top 0.406: R19.2 30.08,63.82 T15.1
N$40
  Top 0.406: T16.1 36.7,65.38 R20.2
N$41
  Top 0.406: T17.1 40.54,62.58 R21.2
N$42
  Top 0.406: T18.1 43.4,59.52 43.4,61.4 42.82,61.98 R22.2
N$43
  Top 0.406: T19.1 42.78,52.84 R23.2
N$44
  Top 0.406: T20.1 38.99,48.21 R24.2
N$45
  Top 0.406: T21.3 60.74,51.03 DGT3.K1
N$46
  Top 0.406: T22.3 59.34,52.9 DGT3.K2
N$47
  Top 0.406: T23.3 57.97,55.16 DGT3.K3
N$48
  Top 0.406: T24.3 58.99,59.06 DGT3.K4
N$49
  Top 0.406: T25.3 61.04,61.93 DGT3.K5
N$50
  Top 0.406: T26.3 63.04,62.65 DGT3.K6
N$51
  Top 0.406: T27.3 65.04,61.88 DGT3.K7
N$52
  Top 0.406: T28.3 68.14,59.06 DGT3.K8
N$53
  Top 0.406: T29.3 67.69,55.16 DGT3.K9
N$54
  Top 0.406: T30.3 66.74,53.34 DGT3.K0
N$55
  Top 0.305: U1.42 71.53,32.67 K6.1
N$56
  Top 0.406: DGT3.A 64.47,51.29 R25.1
N$57
  Top 0.406: T21.1 60.02,48.35 R27.2
N$58
  Top 0.406: R28.2 55.11,51.66 T22.1
N$59
  Top 0.406: R29.2 54.63,57.44 T23.1
N$60
  Top 0.406: R30.2 55.43,61.55 T24.1
N$61
  Top 0.406: R31.2 58,63.9 T25.1
N$62
  Top 0.406: T26.1 64.92,64.71 R32.2
N$63
  Top 0.406: T27.1 67.42,61.05 R33.2
N$64
  Top 0.406: T28.1 70.53,58.13 71.2,59 71.2,61.57 R34.2
N$65
  Top 0.406: T29.1 70.71,51.64 R35.2
N$66
  Top 0.406: T30.1 66.79,48.68 R36.2
N$67
  Top 0.406: T31.3 80.84,51.1 DGT4.K1
N$68
  Top 0.406: T32.3 79.44,52.67 DGT4.K2
N$69
  Top 0.406: T33.3 78.39,55.21 DGT4.K3
N$70
  Top 0.406: T34.3 79.41,59.11 DGT4.K4
N$71
  Top 0.406: T35.3 81.14,62.3 DGT4.K5
N$72
  Top 0.406: DGT4.K6 83.28,60.85 T36.3
N$73
  Top 0.406: DGT4.K7 85.42,60.69 T37.3
N$74
  Top 0.406: T38.3 88.36,59.11 DGT4.K8
N$75
  Top 0.406: T39.3 88.17,55.21 DGT4.K9
N$76
  Top 0.406: T40.3 86.9,53.51 DGT4.K0
N$77
  Top 0.406: IC3.2 121.45,22.73 C17.2
N$78
  Top 0.406: DGT4.A 84.47,51.24 R37.1
N$79
  Top 0.406: T31.1 80.02,48.68 R39.2
N$80
  Top 0.406: R40.2 75.26,51.86 76.2,52.8 76.57,52.8 T32.1
N$81
  Top 0.406: R41.2 74.93,57.6 T33.1
N$82
  Top 0.406: R42.2 75.83,61.62 T34.1
N$83
  Top 0.406: R43.2 78.39,63.98 T35.1
N$84
  Top 0.406: T36.1 R44.2
N$85
  Top 0.406: T37.1 88.67,62.04 R45.2
N$86
  Top 0.305: T38.1 90.52,58.28 R46.2
N$87
  Top 0.406: T39.1 91.16,53.28 R47.2
N$88
  Top 0.406: T40.1 87.58,49.83 R48.2
N$89
  Top 0.406: T41.3 108.79,51.25 DGT5.K1
N$90
  Top 0.406: T42.3 107.39,52.32 DGT5.K2
N$91
  Top 0.406: T43.3 DGT5.K3
N$92
  Top 0.406: T44.3 107.11,59.11 DGT5.K4
N$93
  Top 0.406: T45.3 109.09,61.82 DGT5.K5
N$94
  Top 0.406: T46.3 111.09,62.49 DGT5.K6
N$95
  Top 0.406: T47.3 113.09,62.09 DGT5.K7
N$96
  Top 0.406: T48.3 115.72,59.11 DGT5.K8
N$97
  Top 0.406: T49.3 115.7,55.21 DGT5.K9
N$98
  Top 0.406: T50.3 114.79,53.45 DGT5.K0
N$99
  Top 0.305: U1.86 72.53,12.67 72.2,13 66.81,13 C8.2
N$100
  Top 0.406: DGT5.A 112.47,51.29 R49.1
N$101
  Top 0.406: T41.1 107.74,48.76 R51.2
N$102
  Top 0.406: R52.2 103.82,51.74 T42.1
N$103
  Top 0.406: R53.2 102.84,57.9 T43.1
N$104
  Top 0.305: R54.2 104.44,61.49 T44.1
  Top 0.406: 104.4,60.76 T44.1
N$105
  Top 0.305: R55.2 106.26,63.58 T45.1
N$106
  Top 0.406: T46.1 112.12,65.36 R56.2
N$107
  Top 0.406: T47.1 115.74,61.74 R57.2
N$108
  Top 0.406: T48.1 119.4,58.48 119.4,60.2 118.84,60.76 R58.2
N$109
  Top 0.305: T49.1 119.27,53.07 119.9,53.7 120.53,53.7 R59.2
N$110
  Top 0.406: T50.1 115.15,48.46 R60.2
N$111
  Top 0.406: T51.3 128.74,51.17 DGT6.K1
N$112
  Top 0.406: T52.3 127.34,52.94 DGT6.K2
N$113
  Top 0.406: T53.3 126.54,55.23 DGT6.K3
N$114
  Top 0.406: T54.3 126.58,59.11 DGT6.K4
N$115
  Top 0.406: T55.3 129.04,61.57 DGT6.K5
N$116
  Top 0.406: T56.3 131.04,62.24 DGT6.K6
N$117
  Top 0.406: T57.3 133.04,61.84 DGT6.K7
N$118
  Top 0.406: T58.3 135.02,59.11 DGT6.K8
N$119
  Top 0.406: T59.3 135.73,55.21 DGT6.K9
N$120
  Top 0.406: T60.3 135.06,53.51 DGT6.K0
N$121
  Top 0.406: R6.2 118,21.6 119.1,22.7 119.71,22.7 C17.1
N$122
  Top 0.406: DGT6.A 132.47,51.34 R61.1
N$123
  Top 0.406: T51.1 127.23,47.08 R63.2
N$124
  Top 0.406: R64.2 123.43,52.02 T52.1
N$125
  Top 0.406: R65.2 122.65,58.05 T53.1
N$126
  Top 0.305: T54.1 124.09,62.29 125.2,63.4 125.2,64.23 R66.2
N$127
  Top 0.305: T55.1 126.59,63.99 127,64.4 127.79,64.4 R67.2
N$128
  Top 0.406: T56.1 132.2,64.41 R68.2
N$129
  Top 0.406: T57.1 136.64,61.21 R69.2
N$130
  Top 0.406: T58.1 138.29,57.29 139,58 139,61.35 R70.2
N$131
  Top 0.406: T59.1 138.76,52.41 R71.2
N$132
  Top 0.406: T60.1 135.33,48.68 R72.2
N$133
  Bottom 0.61: B1.+ B1.+@1 29.82,29.08 P4.1
N$134
  Top 0.406: C19.1 R11.2 R14.2 111.6,16.59 R26.2 | IC3.3 120.06,21.46 118.8,20.2 114.9,20.2 114,21.1 112.1,21.1 111.61,20.61 C19.1 | 111.6,19.61 C19.1
N$135
  Top 0.305: U1.43 71.03,31.27 K7.1
N$136
  Top 0.61: IC3.6 131.03,21.46 131.7,20.8 131.7,19.4 131,18.7 122.5,18.7 120.5,16.7 120.5,14.8 119.8,14.8 T6.1
N$137
  Top 0.406: R75.2 116.84,15.85 R38.1
  Top 0.61: T6.2 119.7,10.3 R50.2 R62.2 R75.2
N$138
  Top 0.305: U1.44 70.53,29.97 67.6,32.9 K8.1
N$139  (via drill 0.6)
  Top 0.406: R38.2 118.31,17.49 v118.5,17.3 | IC3.1 119.5,24 v118.9,24.6 118.89,24.6 C18.2
  Bottom 0.406: v118.5,17.3 118.5,24.2 v118.9,24.6
N$140
  Top 0.61: IC3.7 131.08,22.73 R76.2
N$141
  Top 0.61: L1.P$1 130.04,3.63 D3.A 129.6,3.19 129.6,9.4 126.7,12.3 T6.3
  pour Top (isolate 1.016): 121.2,16.6 121.6,2.3 123,1.4 144.2,1.3 145.7,3 145.7,17.5 144.2,19.1 123.5,18.9
N$142  (via drill 0.6)
  Top 0.305: v29.2,25.4 25.5,25.4 23.7,23.6 23.7,10.6 23,9.9 IC1.16
  Bottom 0.305: P4.2 29.8,26 v29.2,25.4
RX
  Top 0.305: U1.31 77.03,32.57 75.5,34.1 64.4,34.1 54.4,24.1 48.7,24.1 46.9,25.9 46.9,28.8 46.5,29.2 46.6,29.2 K5.RX_RS232
SCLK  (via drill 0.6)
  Top 0.305: IC1.18 23.36,7.36 25.7,9.7 25.7,20.1 27.7,22.1 46,22.1 v48.2,19.9 | U1.35 75.03,25.93 74.6,25.5 v74.6,24.9
  Bottom 0.305: v74.6,24.9 71.9,22.2 60.1,22.2 57.8,19.9 v48.2,19.9
SDIO  (via drill 0.6)
  Top 0.305: U1.20 80.54,23.04 v79.4,21.9
  Bottom 0.305: K3.5 92.62,21.18 91,22.8 81.5,22.8 80.1,24.2 79,24.2 78.4,23.6 78.4,22.4 78.8,22 v79.4,21.9
TL1
  Top 0.305: U1.29 78.03,29.23 79.6,30.8 99.8,30.8 101.9,32.9 101.9,33.98 S1.2
TL2
  Top 0.305: U1.28 78.53,28.93 79.6,30 114.4,30 116.9,32.5 116.9,33.98 S2.2
TL3
  Top 0.305: U1.27 79.03,28.73 79.4,29.1 128.9,29.1 131.7,31.9 131.7,34.18 S3.2
TX
  Top 0.305: U1.30 77.53,31.89 P1.1
U_ANODE
  Top 0.406: R13.2 36.2,43.96 47.53,43.96 R8.2 47.7,44.13 R7.2 51.1,44.03 64.49,44.03 | 64.49,44.03 64.6,43.92 | R49.2 112.6,43.84 | K1.59 135.93,73.97 143.8,66.1 143.8,48.6 139.1,43.9 132.5,43.9 arc90 132.43,43.97 | 64.49,44.03 84.49,44.03 R37.2 84.6,43.88 95.65,43.88 R10.2 R9.2 98.96,43.97 R49.2 | 64.49,44.03 R25.2 | 36.13,44.03 R13.2 | 132.43,43.97 R49.2 | R61.2 arc-90 132.43,43.97 | R13.2 36.03,44.13 R1.2
U_ANODEP  (via drill 0.6)
  Top 0.305: v111.6,7.8 R26.1
  Top 0.61: K2.59 111.57,2.1 116.4,2.1 116.51,2.21 C20.1 118.09,2.5 122.8,2.5 123.43,3.13 D3.K
  Bottom 0.305: K2.59 112.83,2.03 114.1,3.3 114.1,5.3 v111.6,7.8
XRES  (via drill 0.6)
  Top 0.305: U1.15 79.5,20.54 v79.4,20.5
  Bottom 0.305: K3.3 103.2,19.4 91.8,19.4 89.9,21.3 80.3,21.3 v79.4,20.5

### Text on the board
tPlace: NIXIE CLOCK | 160920 MZ | NIXIE CLOCK | 160920 MZ